# EAGLE schematic soundpuddle_standalone_mk1 (EAGLE 6.3)

## Sheet 1 of 2
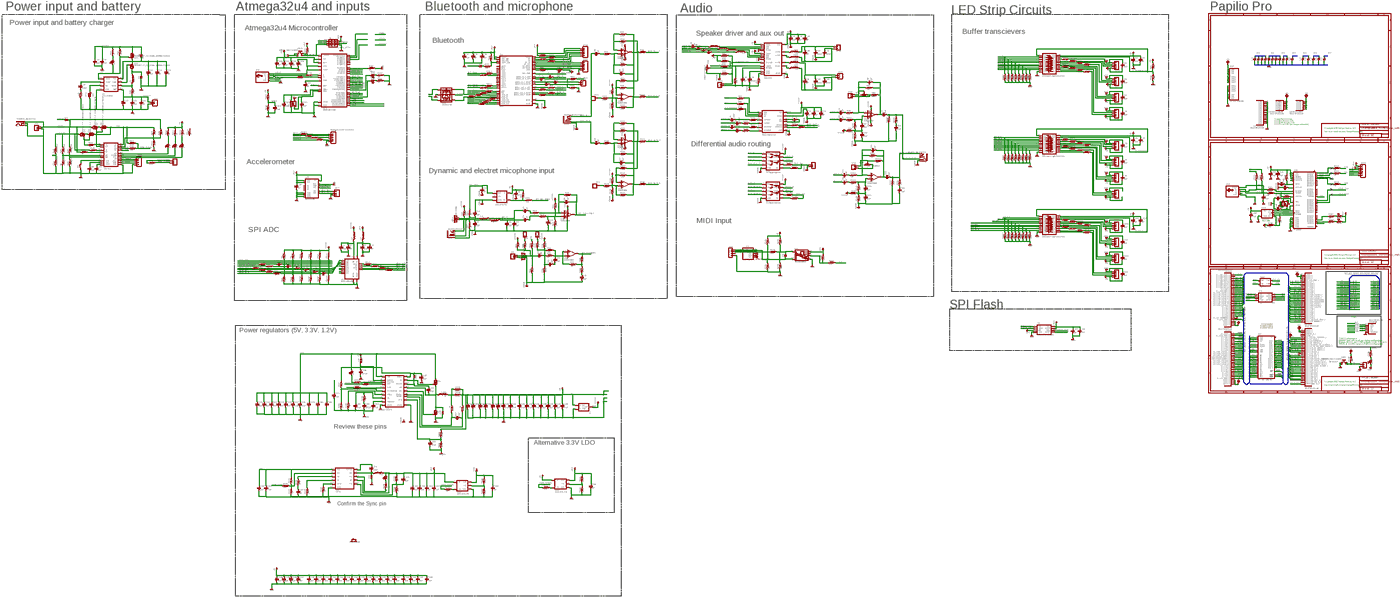
[diagram p0: schematic, sheet 1, overview]
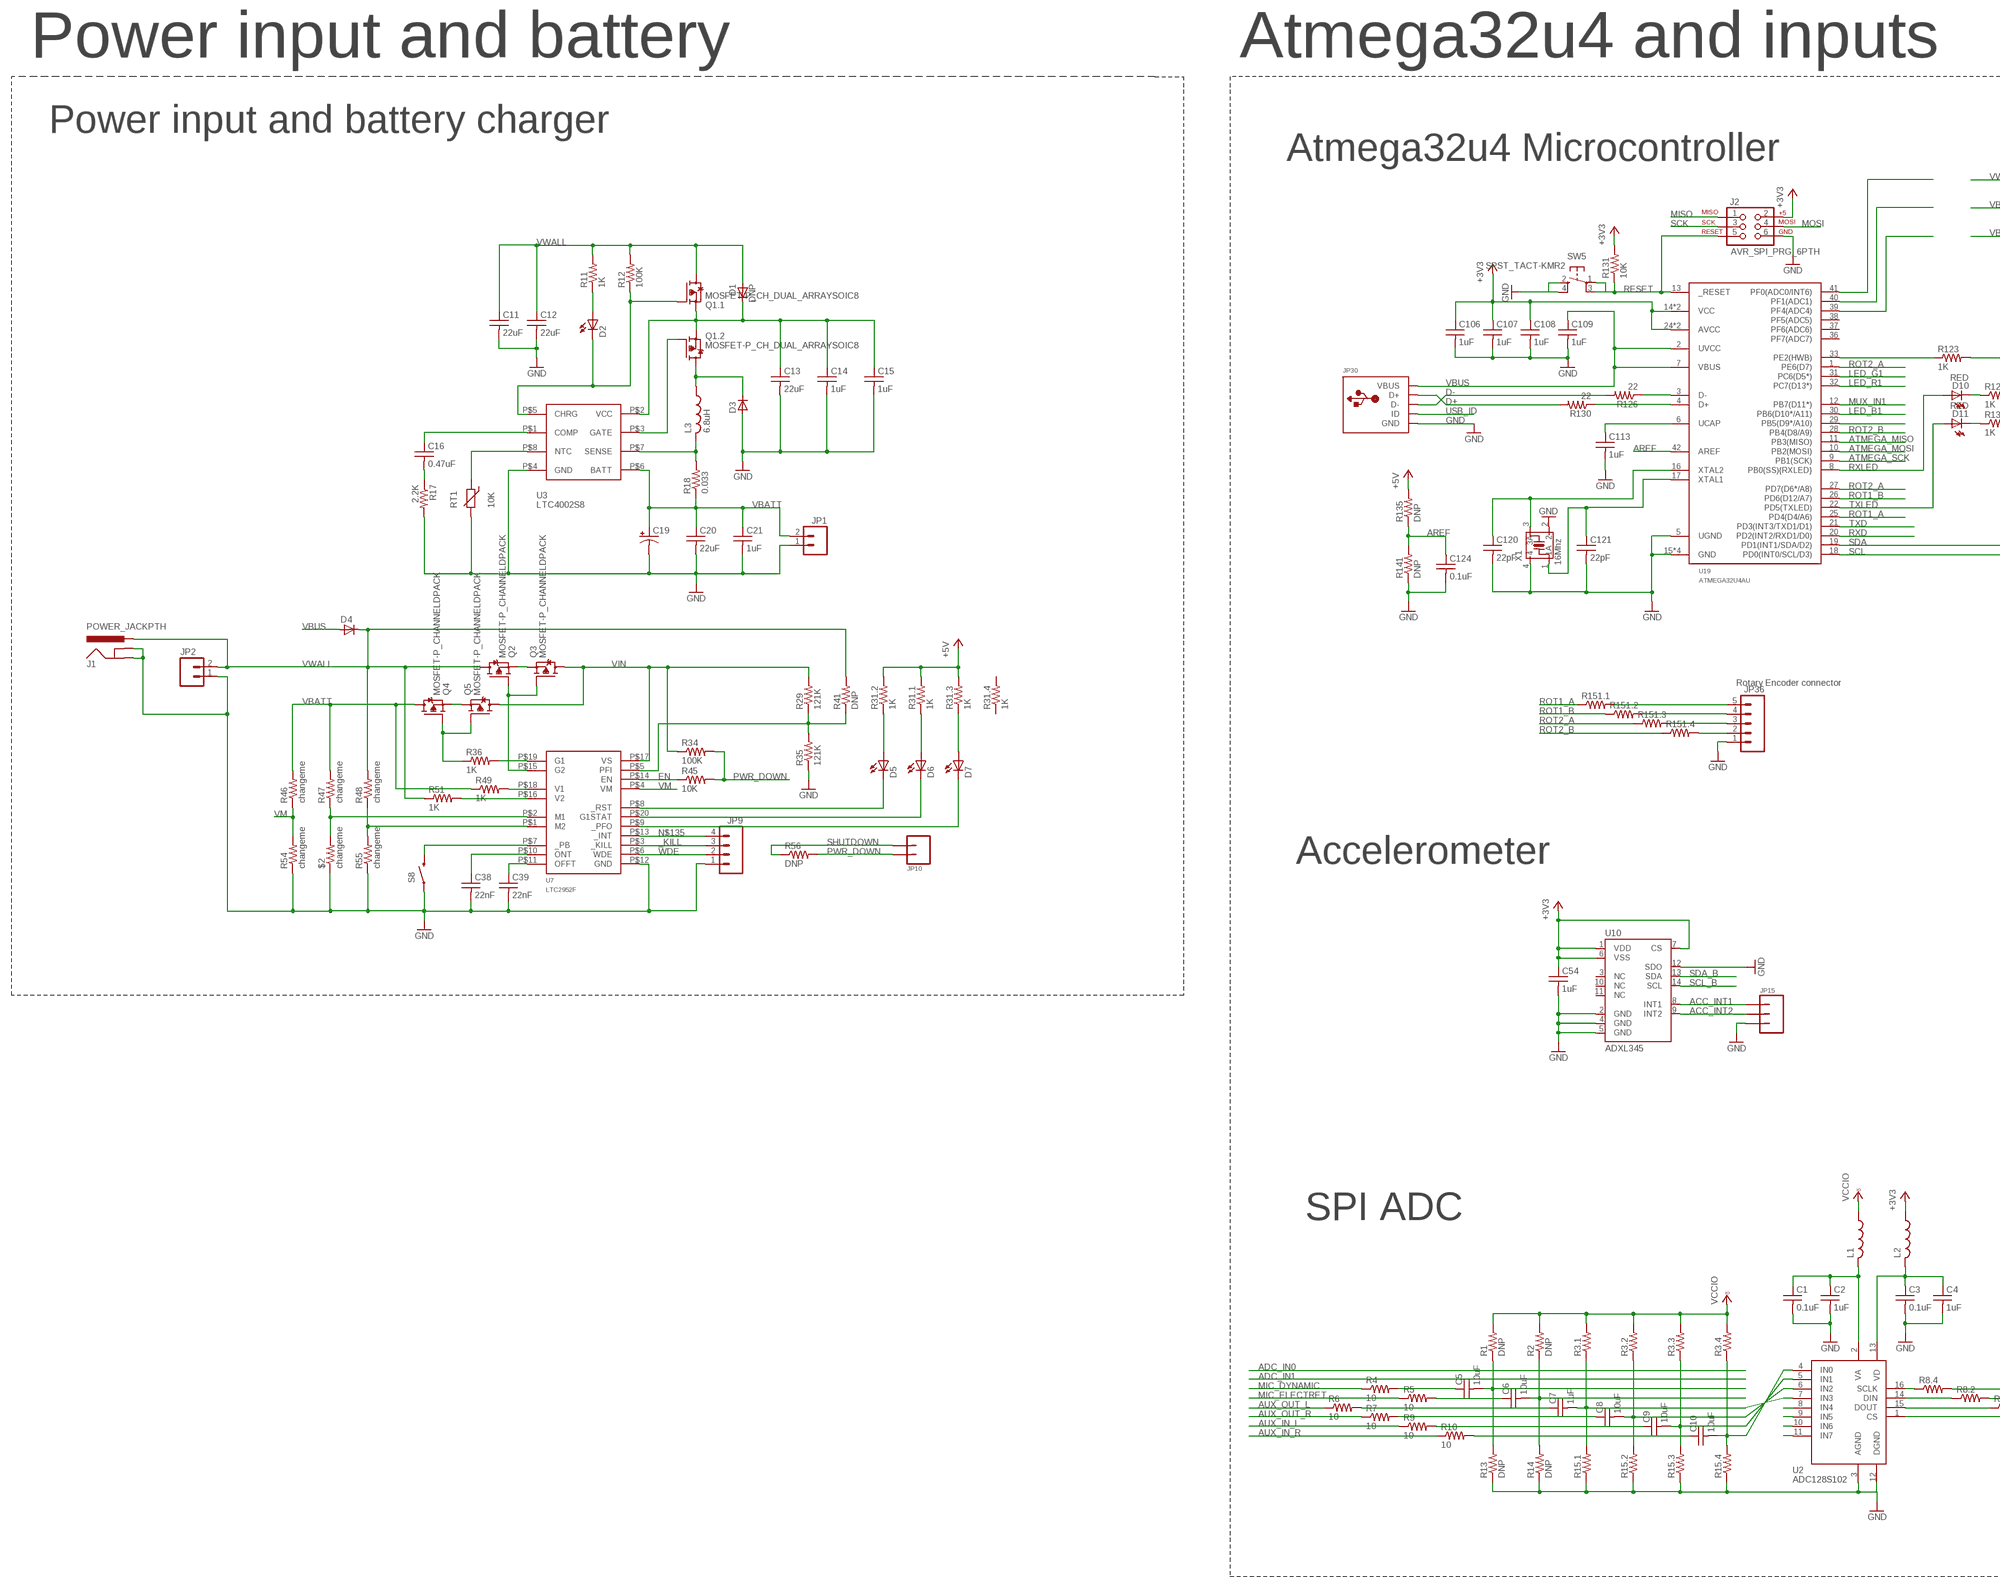
[diagram p1: schematic, sheet 1, part 1 of 7]
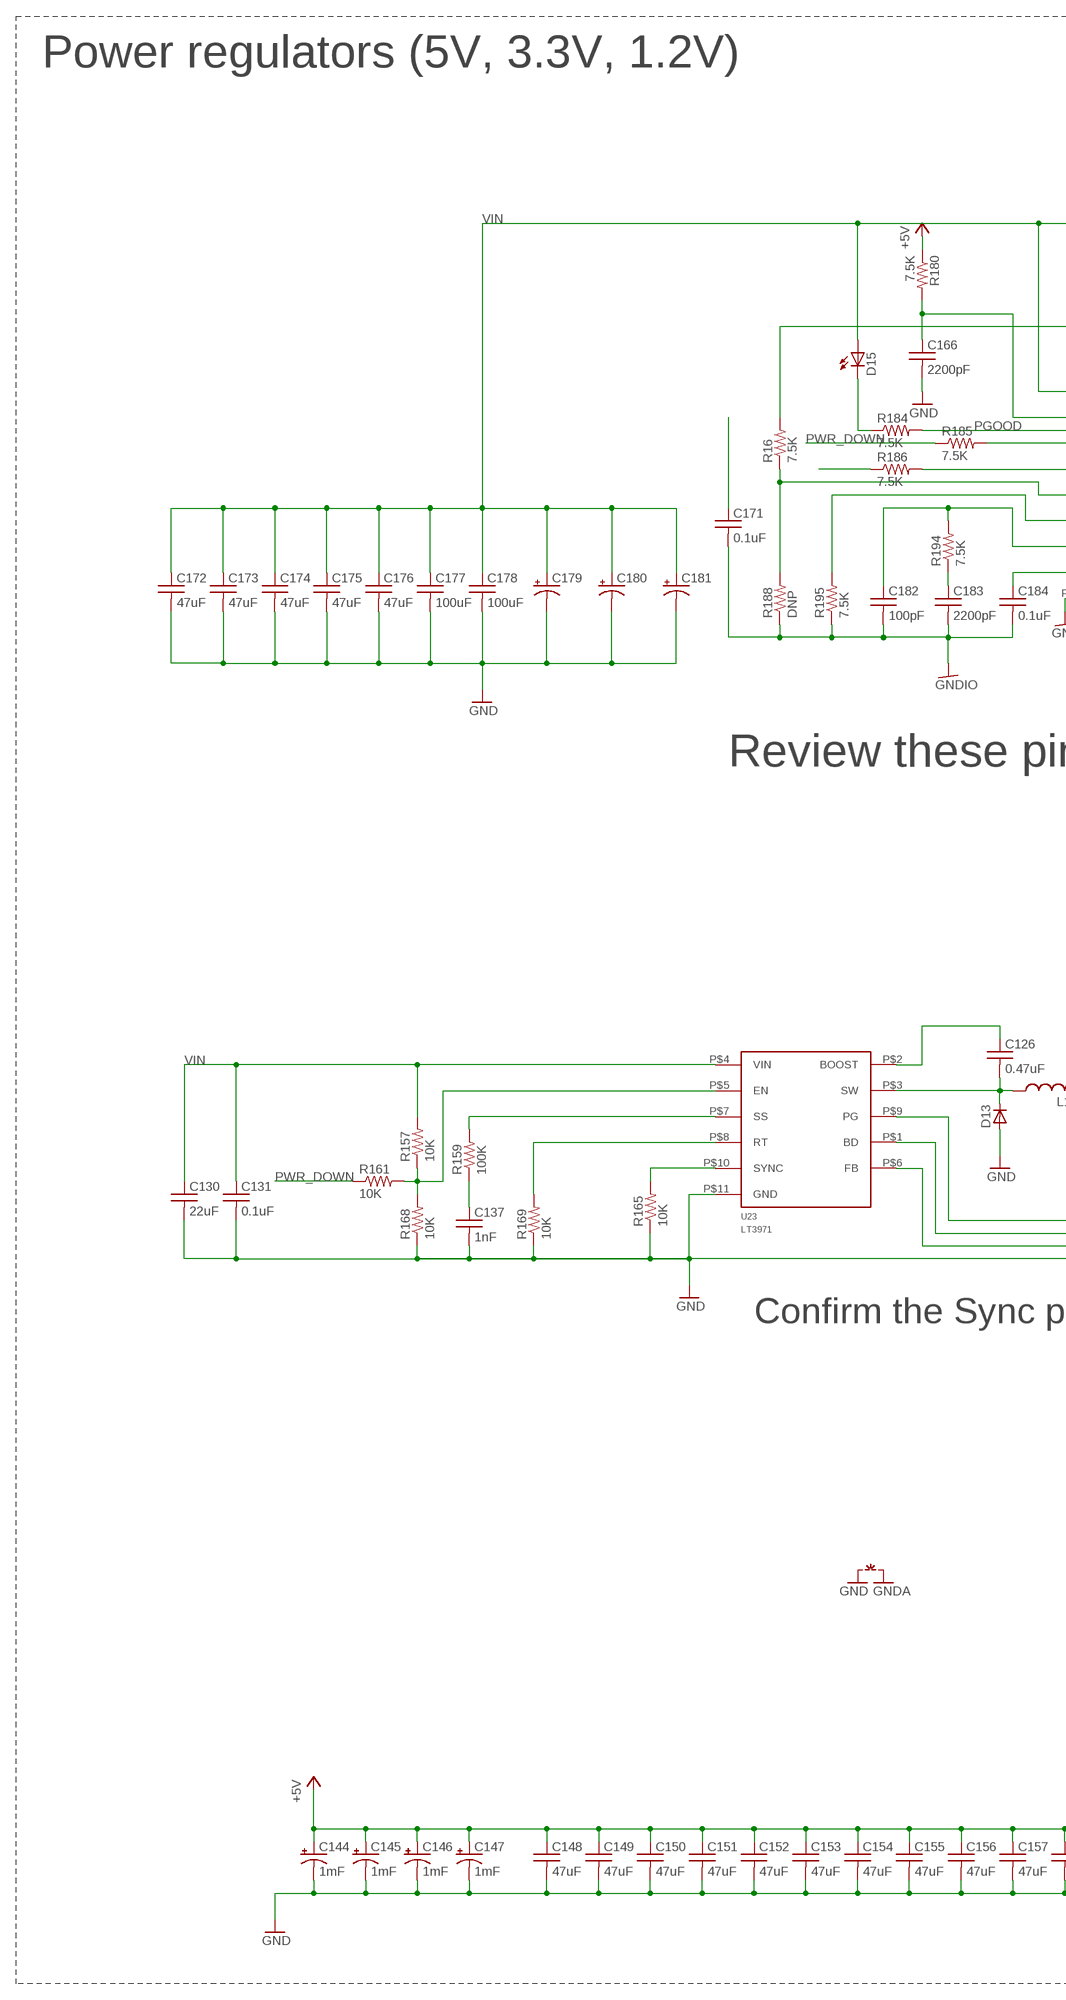
[diagram p2: schematic, sheet 1, part 2 of 7]
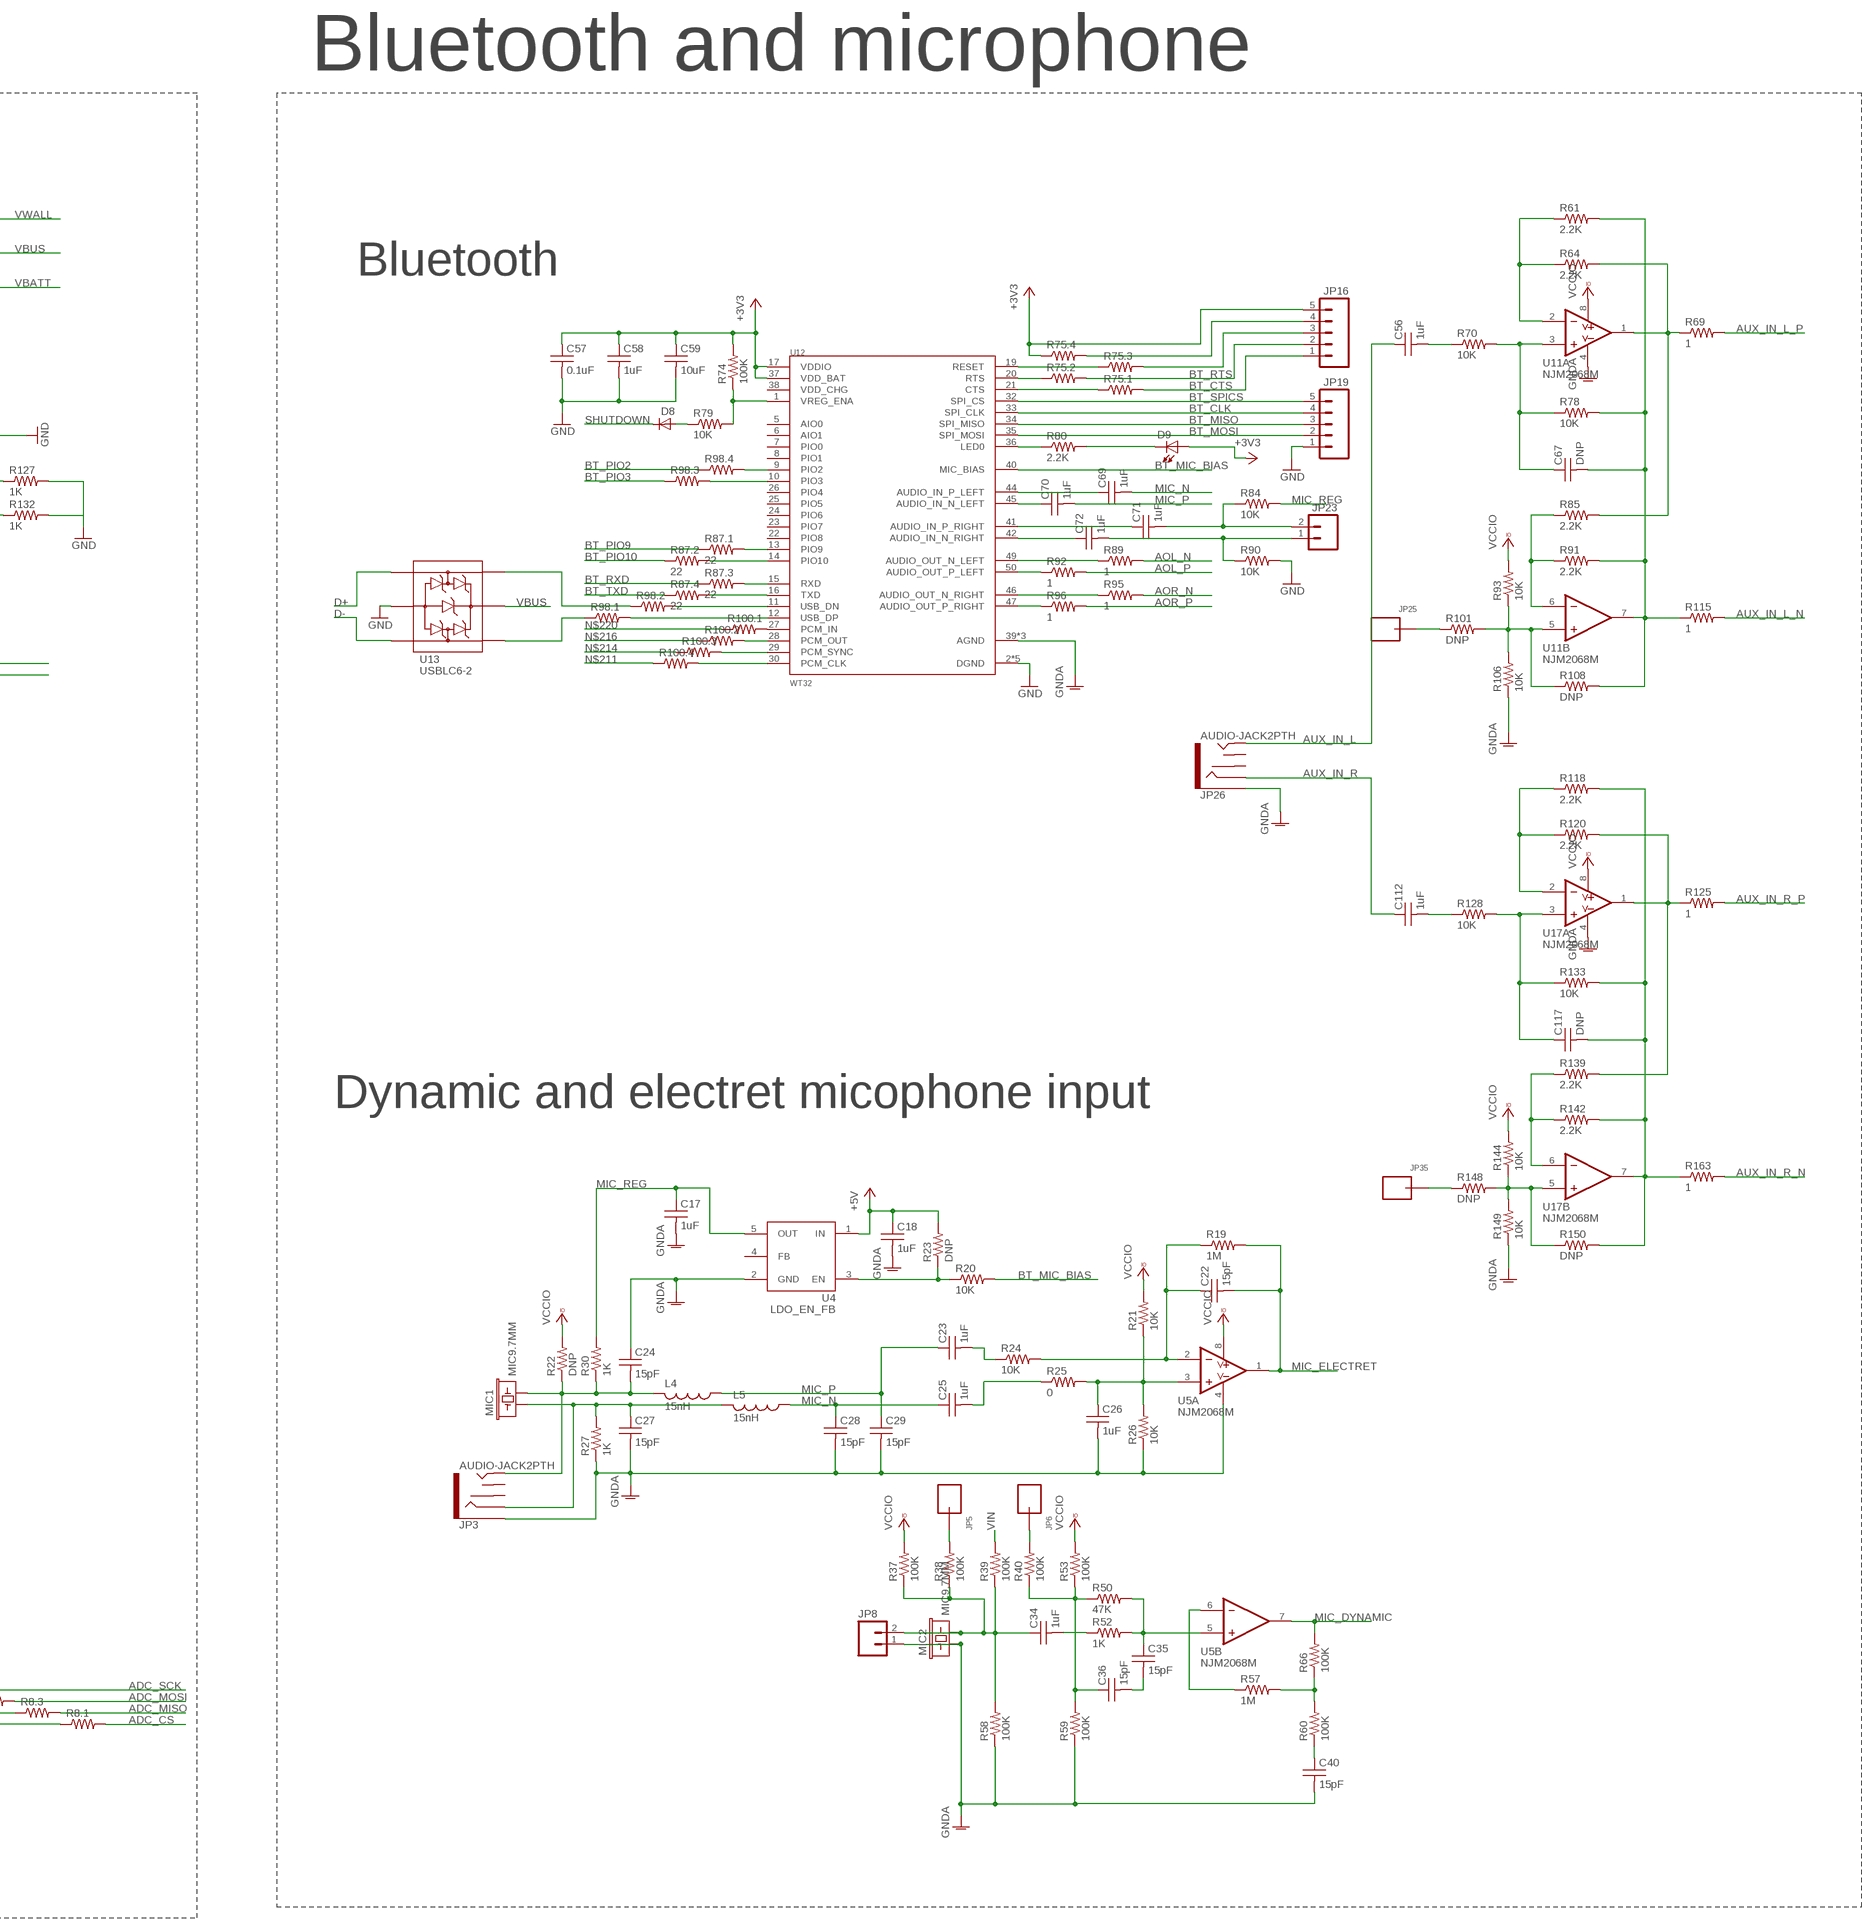
[diagram p3: schematic, sheet 1, part 3 of 7]
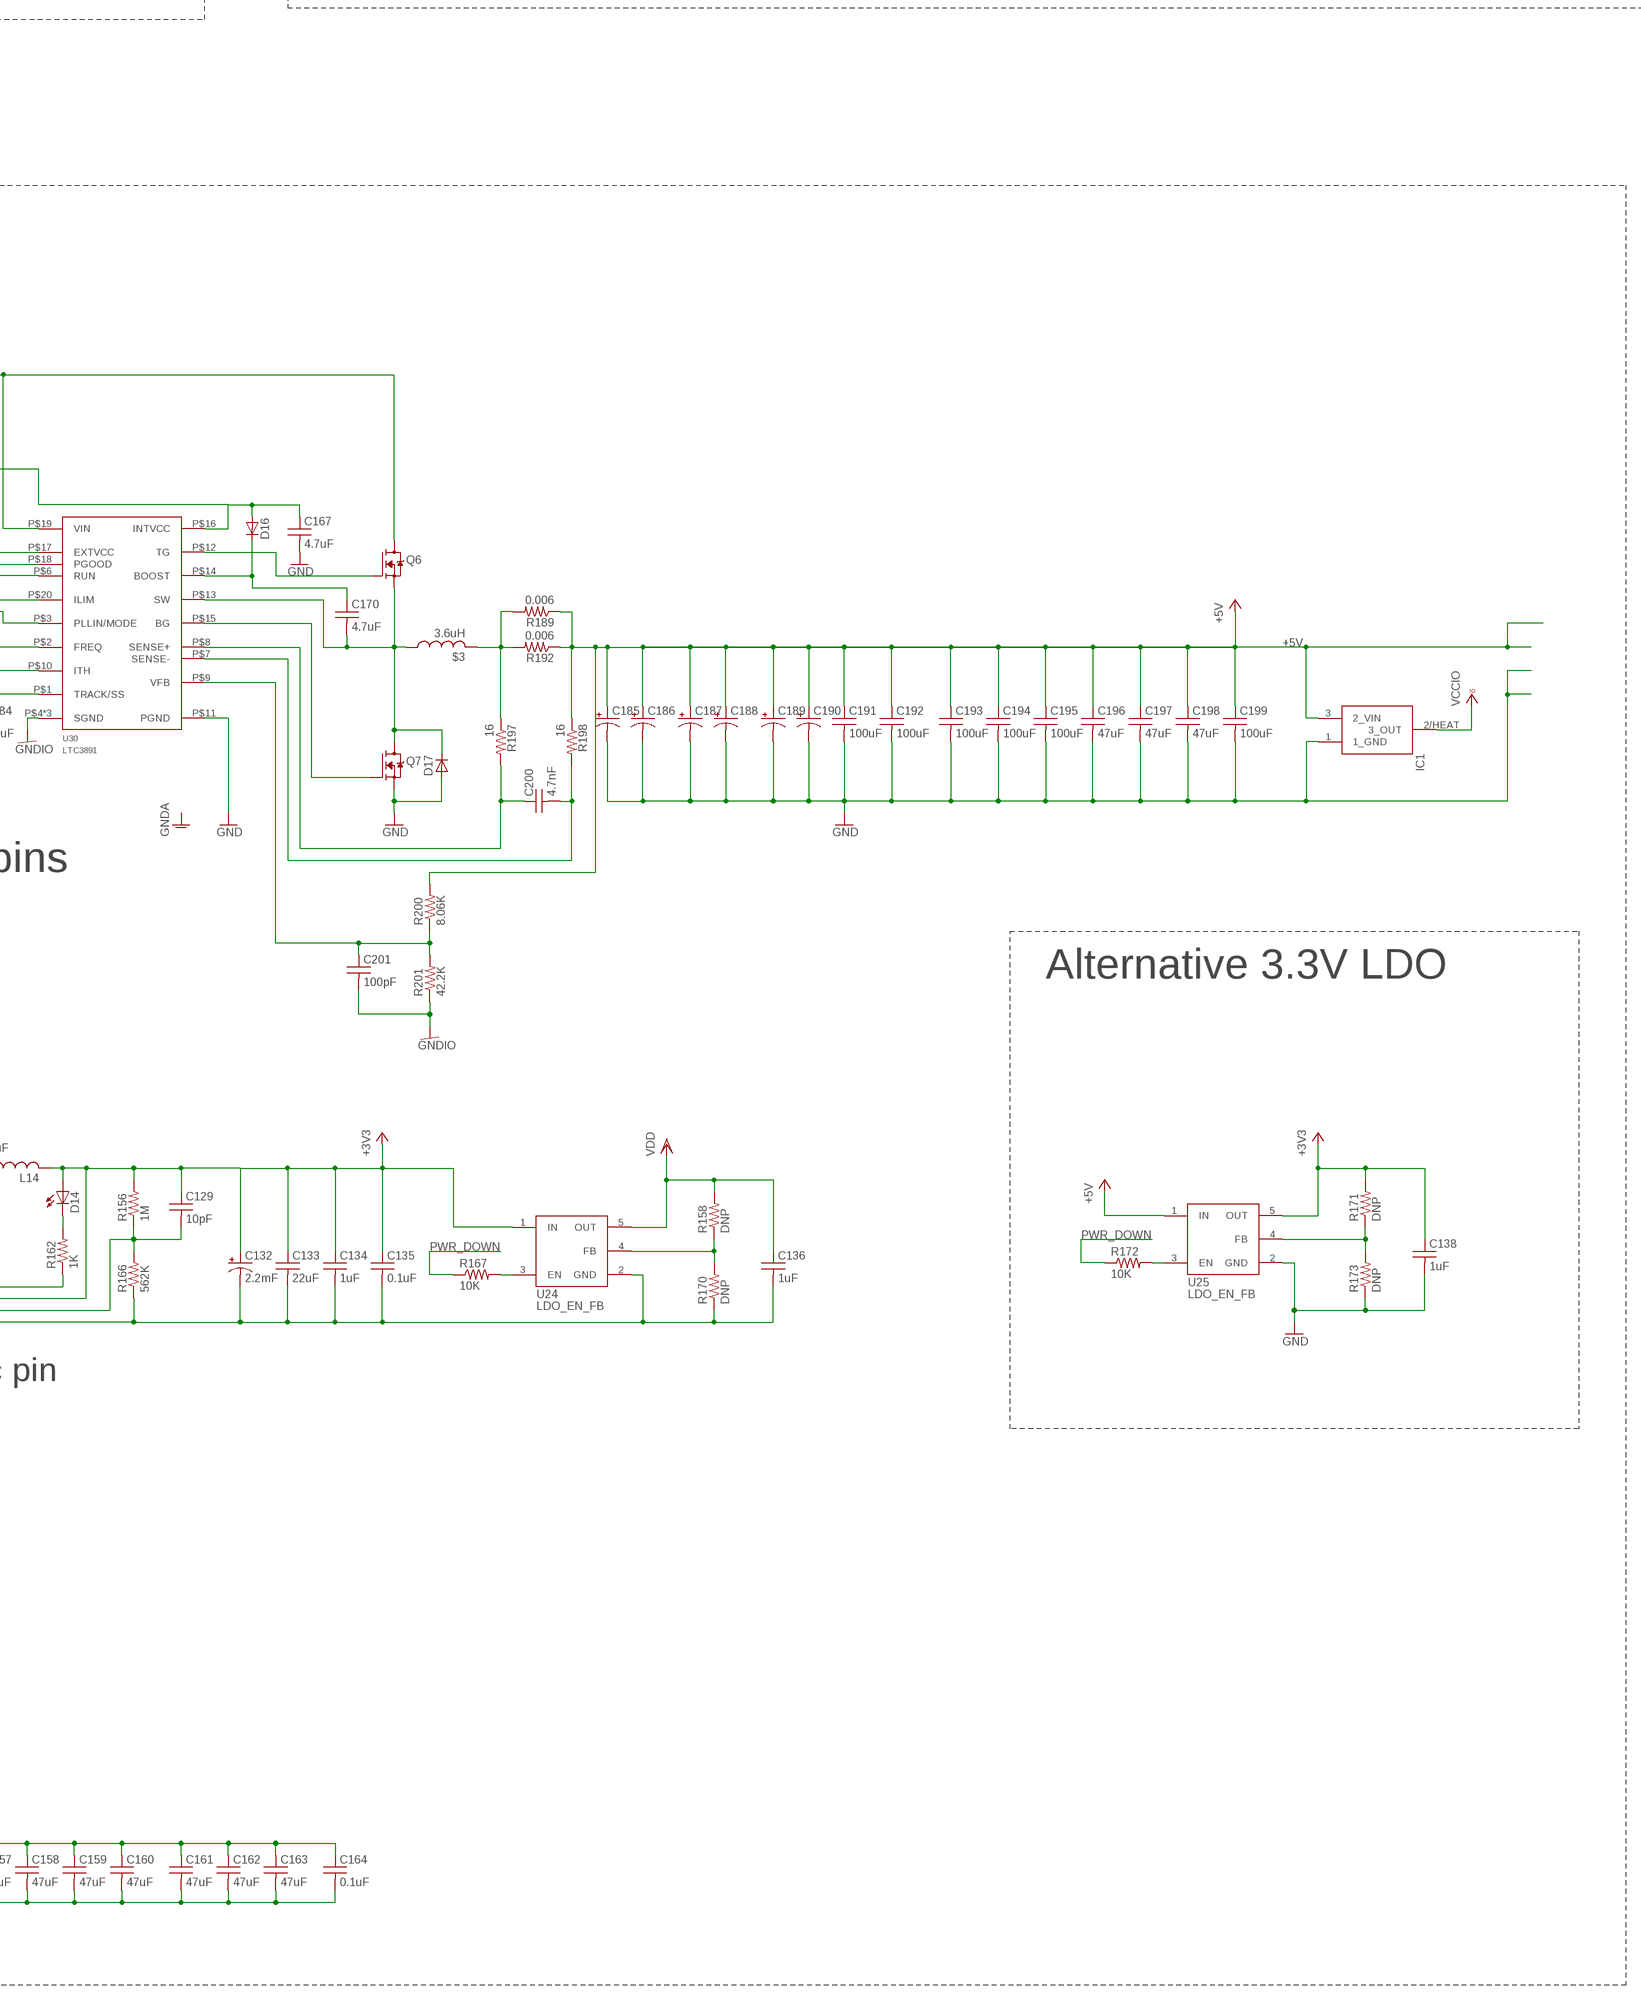
[diagram p4: schematic, sheet 1, part 4 of 7]
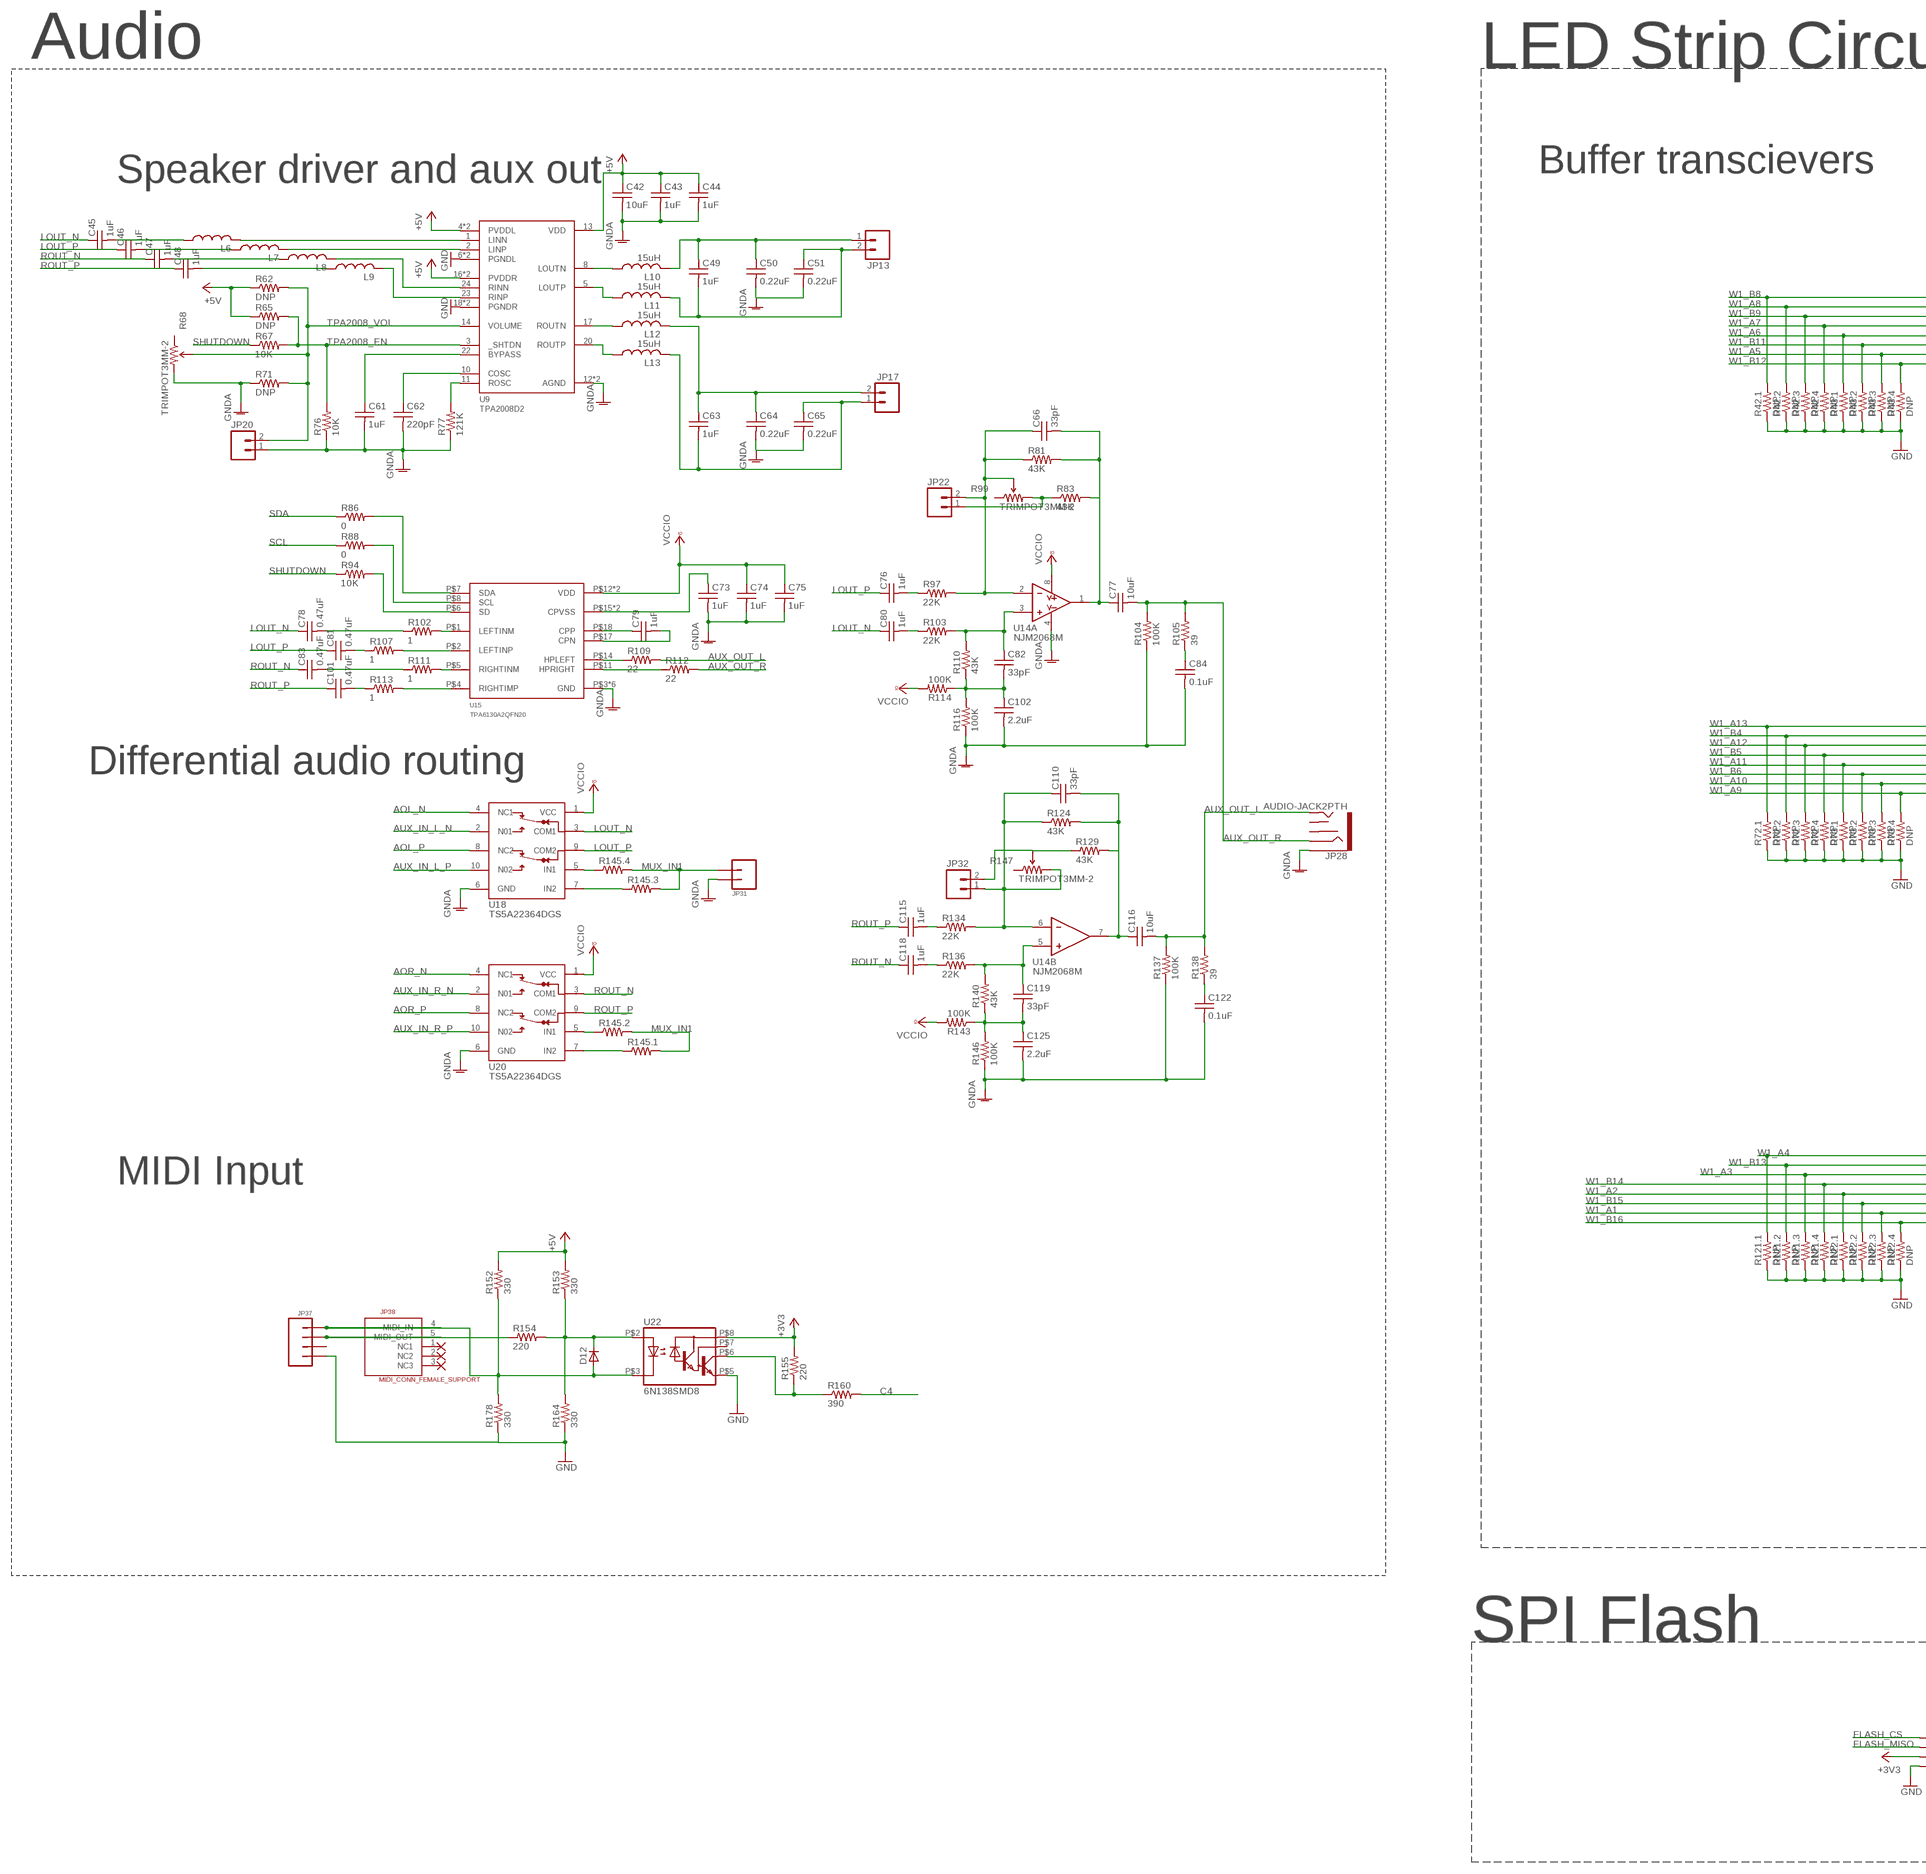
[diagram p5: schematic, sheet 1, part 5 of 7]
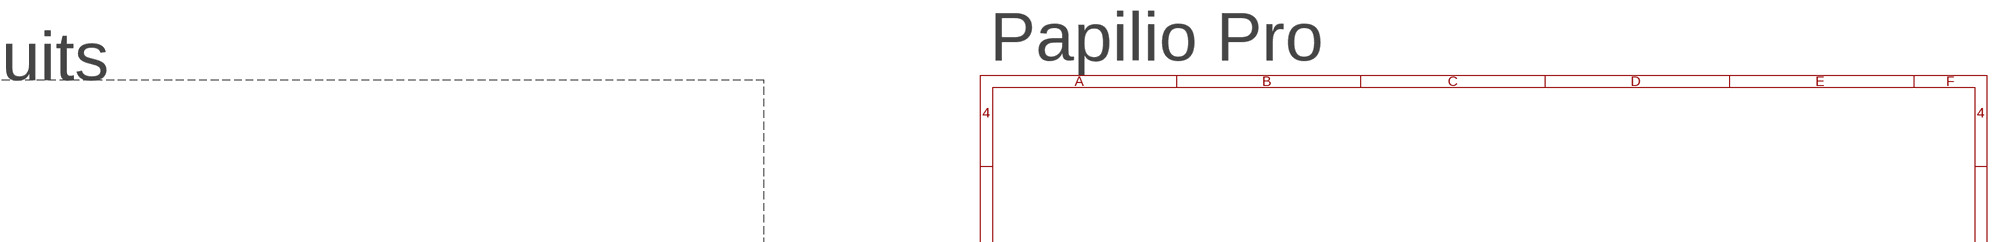
[diagram p6: schematic, sheet 1, part 6 of 7]
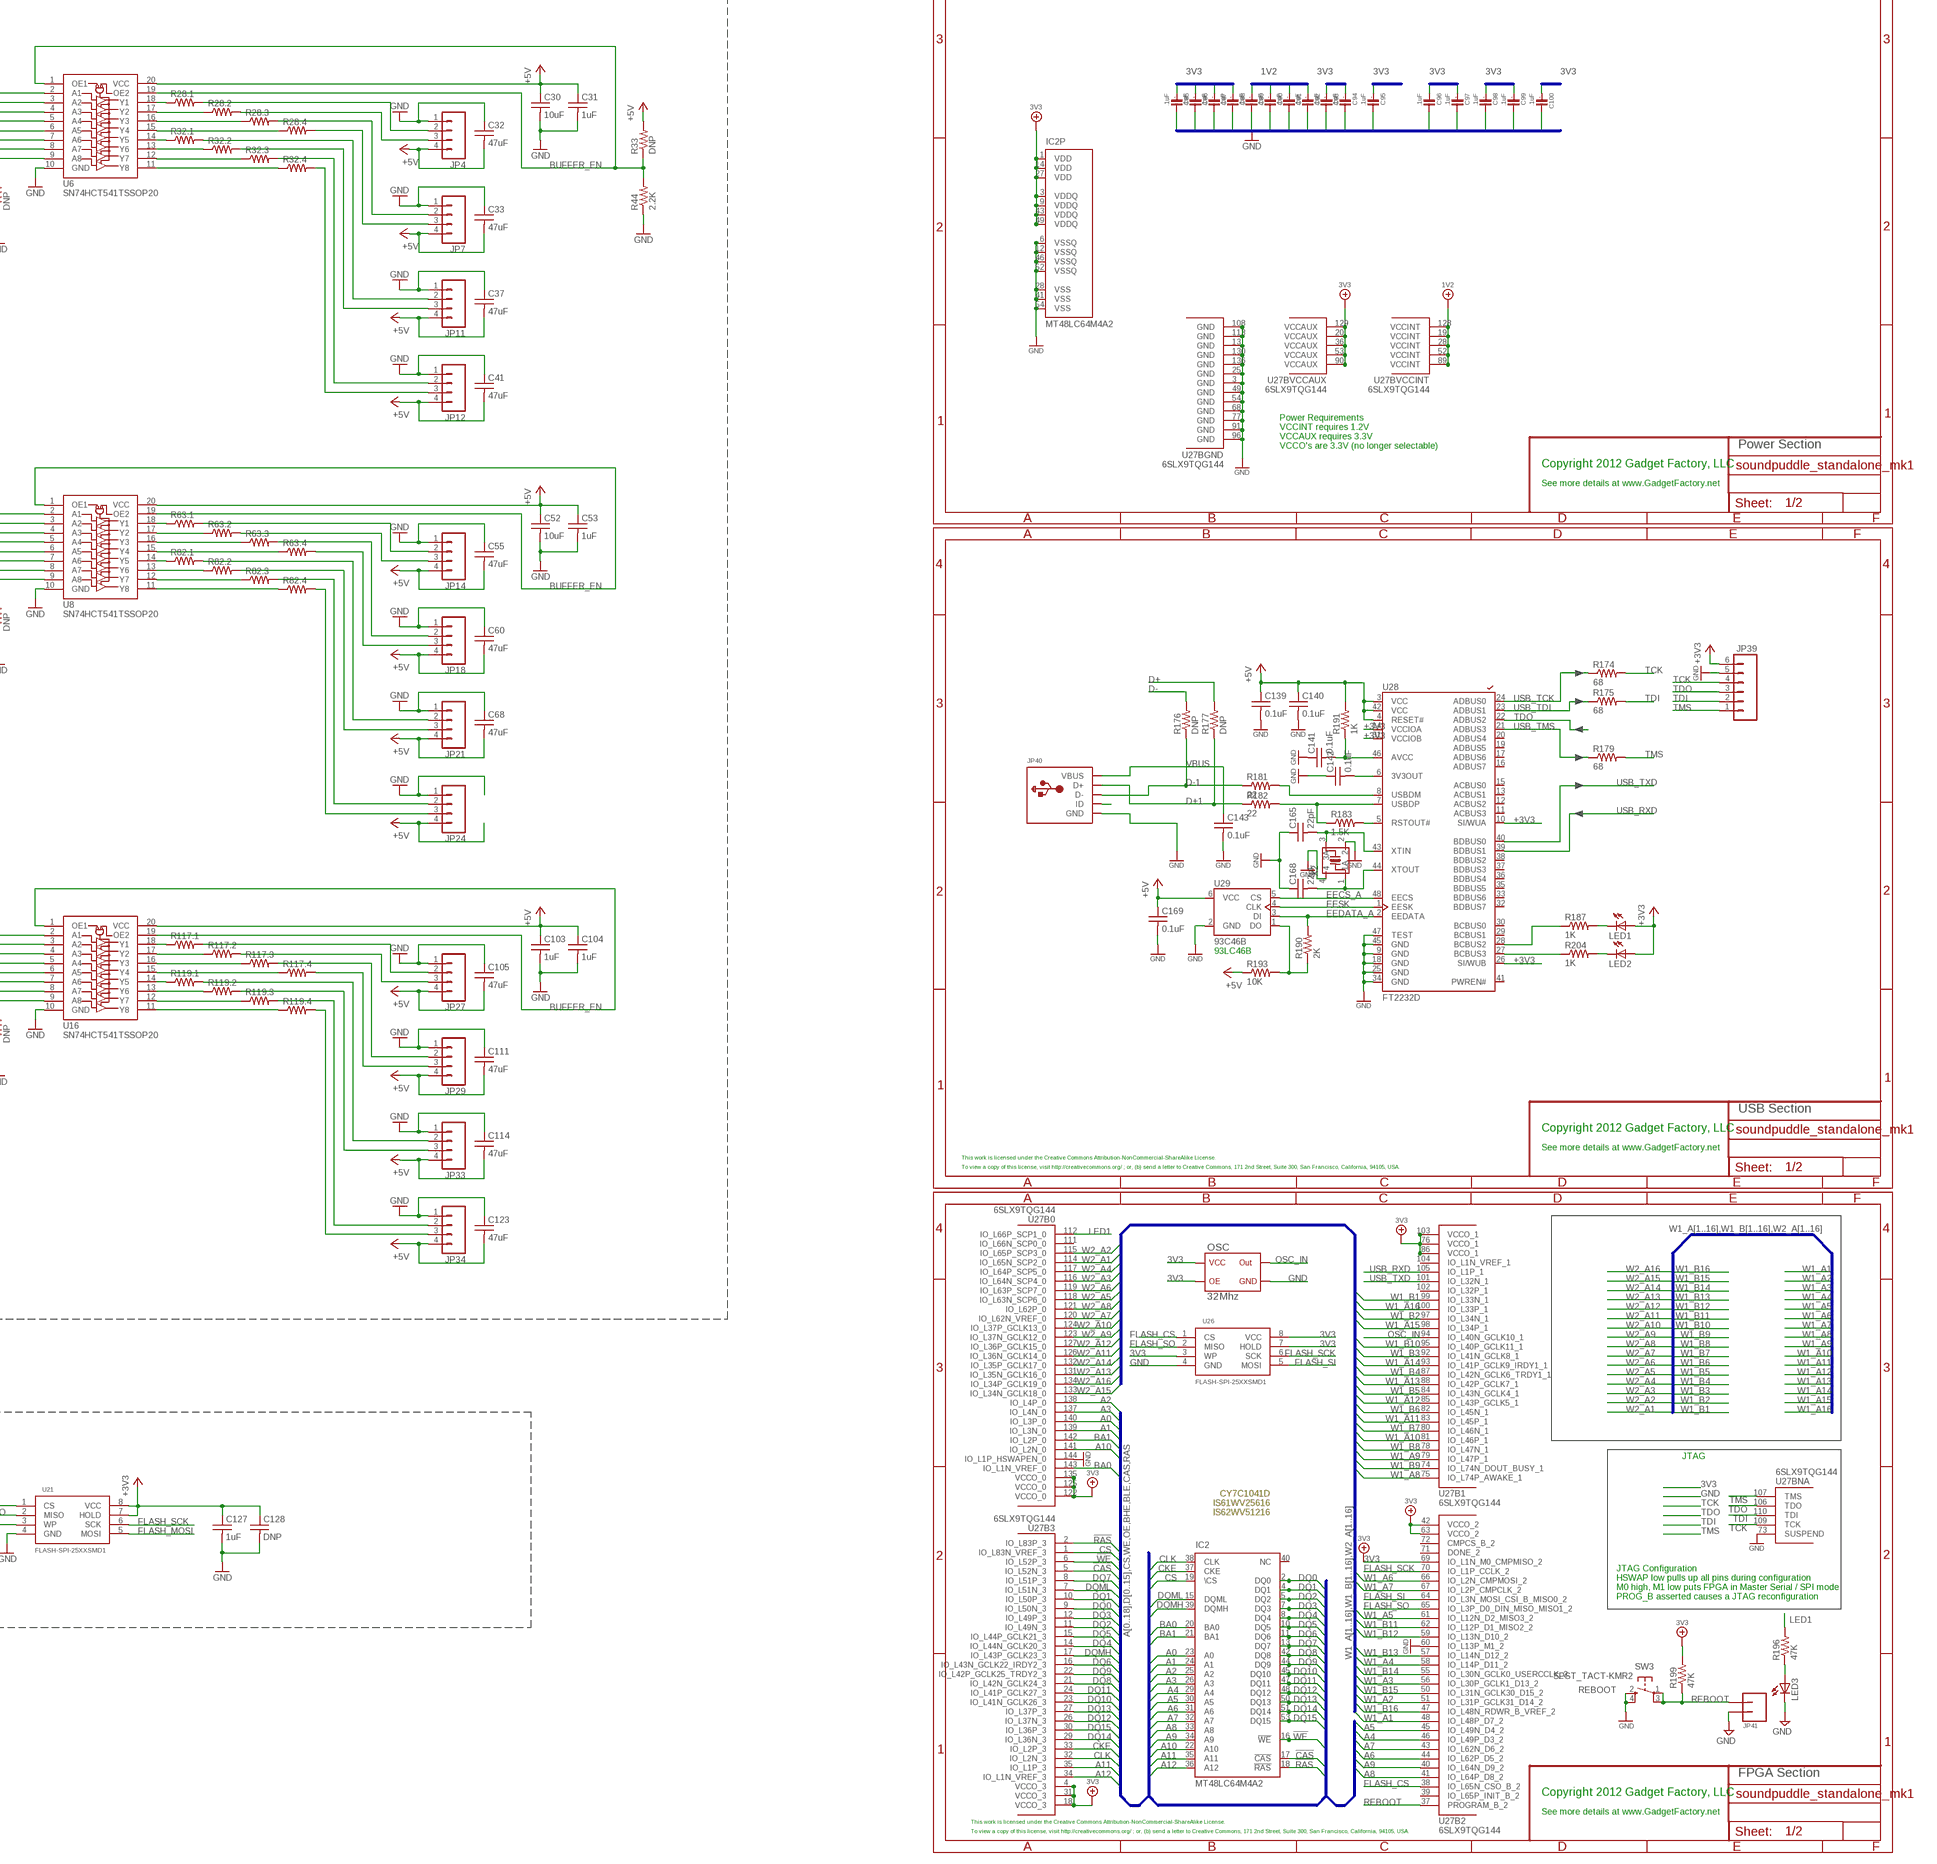
[diagram p7: schematic, sheet 1, part 7 of 7]

### Parts
$2  changeme  RESISTORR_0603  [0603]
$3  3.6uH  INDUCTORHC1  [INDUCTOR_HC1]
C1  0.1uF  CAPACITORC_0603  [0603]
C2  1uF  CAPACITORC_0603  [0603]
C3  0.1uF  CAPACITORC_0603  [0603]
C4  1uF  CAPACITORC_0603  [0603]
C5  10uF  CAPACITORC_0805  [0805]
C6  10uF  CAPACITORC_0805  [0805]
C7  1uF  CAPACITORC_0805  [0805]
C8  10uF  CAPACITORC_0805  [0805]
C9  10uF  CAPACITORC_0805  [0805]
C10  10uF  CAPACITORC_0805  [0805]
C11  22uF  CAPACITORC_0603  [0603]
C12  22uF  CAPACITORC_1206  [1206]
C13  22uF  CAPACITORC_1206  [1206]
C14  1uF  CAPACITORC_0603  [0603]
C15  1uF  CAPACITORC_0603  [0603]
C16  0.47uF  CAPACITORC_0603  [0603]
C17  1uF  CAPACITORC_0805  [0805]
C18  1uF  CAPACITORC_0603  [0603]
C19  CAPACITOR_ELEC6.3MM_DIA  [CAP_RADIAL_THRUHOLE_6.3MM_DIA]
C20  22uF  CAPACITORC_1206  [1206]
C21  1uF  CAPACITORC_0603  [0603]
C22  15pF  CAPACITORC_0603  [0603]
C23  1uF  CAPACITORC_0805  [0805]
C24  15pF  CAPACITORC_0603  [0603]
C25  1uF  CAPACITORC_0805  [0805]
C26  1uF  CAPACITORC_0603  [0603]
C27  15pF  CAPACITORC_0603  [0603]
C28  15pF  CAPACITORC_0603  [0603]
C29  15pF  CAPACITORC_0603  [0603]
C30  10uF  CAPACITORC_0603  [0603]
C31  1uF  CAPACITORC_0603  [0603]
C32  47uF  CAPACITORC_1206  [1206]
C33  47uF  CAPACITORC_1206  [1206]
C34  1uF  CAPACITORC_0805  [0805]
C35  15pF  CAPACITORC_0603  [0603]
C36  15pF  CAPACITORC_0603  [0603]
C37  47uF  CAPACITORC_1206  [1206]
C38  22nF  CAPACITORC_0603  [0603]
C39  22nF  CAPACITORC_0603  [0603]
C40  15pF  CAPACITORC_0603  [0603]
C41  47uF  CAPACITORC_1206  [1206]
C42  10uF  CAPACITORC_1206  [1206]
C43  1uF  CAPACITORC_0603  [0603]
C44  1uF  CAPACITORC_0603  [0603]
C45  1uF  CAPACITORC_0805  [0805]
C46  1uF  CAPACITORC_0805  [0805]
C47  1uF  CAPACITORC_0805  [0805]
C48  1uF  CAPACITORC_0805  [0805]
C49  1uF  CAPACITORC_1206  [1206]
C50  0.22uF  CAPACITORC_0603  [0603]
C51  0.22uF  CAPACITORC_0603  [0603]
C52  10uF  CAPACITORC_0603  [0603]
C53  1uF  CAPACITORC_0603  [0603]
C54  1uF  CAPACITORC_0603  [0603]
C55  47uF  CAPACITORC_1206  [1206]
C56  1uF  CAPACITORC_0805  [0805]
C57  0.1uF  CAPACITORC_0603  [0603]
C58  1uF  CAPACITORC_0603  [0603]
C59  10uF  CAPACITORC_1206  [1206]
C60  47uF  CAPACITORC_1206  [1206]
C61  1uF  CAPACITORC_0603  [0603]
C62  220pF  CAPACITORC_0603  [0603]
C63  1uF  CAPACITORC_1206  [1206]
C64  0.22uF  CAPACITORC_0603  [0603]
C65  0.22uF  CAPACITORC_0603  [0603]
C66  33pF  CAPACITORC_0603  [0603]
C67  DNP  CAPACITORC_0603  [0603]
C68  47uF  CAPACITORC_1206  [1206]
C69  1uF  CAPACITORC_0805  [0805]
C70  1uF  CAPACITORC_0805  [0805]
C71  1uF  CAPACITORC_0805  [0805]
C72  1uF  CAPACITORC_0805  [0805]
C73  1uF  CAPACITORC_0805  [0805]
C74  1uF  CAPACITORC_0805  [0805]
C75  1uF  CAPACITORC_0805  [0805]
C76  1uF  CAPACITORC_0805  [0805]
C77  10uF  CAPACITORC_1206  [1206]
C78  0.47uF  CAPACITORC_0805  [0805]
C79  1uF  CAPACITORC_0805  [0805]
C80  1uF  CAPACITORC_0805  [0805]
C81  0.47uF  CAPACITORC_0805  [0805]
C82  33pF  CAPACITORC_0603  [0603]
C83  0.47uF  CAPACITORC_0805  [0805]
C84  0.1uF  CAPACITORC_0603  [0603]
C85  .1uF  C0603  [0603]
C86  .1uF  C0603  [0603]
C87  .1uF  C0603  [0603]
C88  .1uF  C0603  [0603]
C89  .1uF  C0603  [0603]
C90  .1uF  C0603  [0603]
C91  .1uF  C0603  [0603]
C92  .1uF  C0603  [0603]
C93  .1uF  C0603  [0603]
C94  .1uF  C0603  [0603]
C95  .1uF  C0603  [0603]
C96  .1uF  C0603  [0603]
C97  .1uF  C0603  [0603]
C98  .1uF  C0603  [0603]
C99  .1uF  C0603  [0603]
C100  .1uF  C0603  [0603]
C101  0.47uF  CAPACITORC_0805  [0805]
C102  2.2uF  CAPACITORC_0603  [0603]
C103  1uF  CAPACITORC_1206  [1206]
C104  1uF  CAPACITORC_0603  [0603]
C105  47uF  CAPACITORC_1206  [1206]
C106  1uF  CAPACITORC_0603  [0603]
C107  1uF  CAPACITORC_0603  [0603]
C108  1uF  CAPACITORC_0603  [0603]
C109  1uF  CAPACITORC_0603  [0603]
C110  33pF  CAPACITORC_0603  [0603]
C111  47uF  CAPACITORC_1206  [1206]
C112  1uF  CAPACITORC_0805  [0805]
C113  1uF  CAPACITORC_0603  [0603]
C114  47uF  CAPACITORC_1206  [1206]
C115  1uF  CAPACITORC_0805  [0805]
C116  10uF  CAPACITORC_1206  [1206]
C117  DNP  CAPACITORC_0603  [0603]
C118  1uF  CAPACITORC_0805  [0805]
C119  33pF  CAPACITORC_0603  [0603]
C120  22pF  CAPACITORC_0603  [0603]
C121  22pF  CAPACITORC_0603  [0603]
C122  0.1uF  CAPACITORC_0603  [0603]
C123  47uF  CAPACITORC_1206  [1206]
C124  0.1uF  CAPACITORC_0603  [0603]
C125  2.2uF  CAPACITORC_0603  [0603]
C126  0.47uF  CAPACITORC_0603  [0603]
C127  1uF  CAPACITORC_0603  [0603]
C128  DNP  CAPACITORC_1206  [1206]
C129  10pF  CAPACITORC_0603  [0603]
C130  22uF  CAPACITORC_1206  [1206]
C131  0.1uF  CAPACITORC_0603  [0603]
C132  2.2mF  CAPACITOR_ELEC6.3MM_DIA  [CAP_RADIAL_THRUHOLE_6.3MM_DIA]
C133  22uF  CAPACITORC_1206  [1206]
C134  1uF  CAPACITORC_0603  [0603]
C135  0.1uF  CAPACITORC_1206  [1206]
C136  1uF  CAPACITORC_0603  [0603]
C137  1nF  CAPACITORC_0603  [0603]
C138  1uF  CAPACITORC_0603  [0603]
C139  0.1uF  CAPACITORC_0603  [0603]
C140  0.1uF  CAPACITORC_0603  [0603]
C141  0.1uF  CAPACITORC_0603  [0603]
C142  0.1uF  CAPACITORC_0603  [0603]
C143  0.1uF  CAPACITORC_0603  [0603]
C144  1mF  CPOL-USE5-8.5  [E5-8,5]
C145  1mF  CPOL-USE5-8.5  [E5-8,5]
C146  1mF  CPOL-USE5-8.5  [E5-8,5]
C147  1mF  CPOL-USE5-8.5  [E5-8,5]
C148  47uF  CAPACITORC_1206  [1206]
C149  47uF  CAPACITORC_1206  [1206]
C150  47uF  CAPACITOR2200  [2220]
C151  47uF  CAPACITORC_1206  [1206]
C152  47uF  CAPACITORC_1206  [1206]
C153  47uF  CAPACITORC_1206  [1206]
C154  47uF  CAPACITORC_1206  [1206]
C155  47uF  CAPACITORC_1206  [1206]
C156  47uF  CAPACITORC_1206  [1206]
C157  47uF  CAPACITORC_1206  [1206]
C158  47uF  CAPACITORC_1206  [1206]
C159  47uF  CAPACITORC_1206  [1206]
C160  47uF  CAPACITORC_1206  [1206]
C161  47uF  CAPACITORC_1206  [1206]
C162  47uF  CAPACITORC_1206  [1206]
C163  47uF  CAPACITORC_1206  [1206]
C164  0.1uF  CAPACITORC_0603  [0603]
C165  22pF  CAPACITORC_0603  [0603]
C166  2200pF  CAPACITORC_0603  [0603]
C167  4.7uF  CAPACITORC_0603  [0603]
C168  22pF  CAPACITORC_0603  [0603]
C169  0.1uF  CAPACITORC_0603  [0603]
C170  4.7uF  CAPACITORC_0603  [0603]
C171  0.1uF  CAPACITORC_0603  [0603]
C172  47uF  CAPACITOR2200  [2220]
C173  47uF  CAPACITOR2200  [2220]
C174  47uF  CAPACITORC_1206  [1206]
C175  47uF  CAPACITOR2200  [2220]
C176  47uF  CAPACITORC_1206  [1206]
C177  100uF  CAPACITOR2200  [2220]
C178  100uF  CAPACITOR2200  [2220]
C179  CAPACITOR_ELEC12.5MM  [CAP_RADIAL_THRUHOLE_12.5MM_DIA]
C180  CAPACITOR_ELEC12.5MM  [CAP_RADIAL_THRUHOLE_12.5MM_DIA]
C181  CAPACITOR_ELEC6.3MM_DIA  [CAP_RADIAL_THRUHOLE_6.3MM_DIA]
C182  100pF  CAPACITORC_0603  [0603]
C183  2200pF  CAPACITORC_0603  [0603]
C184  0.1uF  CAPACITORC_0603  [0603]
C185  CAPACITOR_ELEC6.3MM_DIA  [CAP_RADIAL_THRUHOLE_6.3MM_DIA]
C186  CAPACITOR_ELEC12.5MM  [CAP_RADIAL_THRUHOLE_12.5MM_DIA]
C187  CAPACITOR_ELEC12.5MM  [CAP_RADIAL_THRUHOLE_12.5MM_DIA]
C188  CAPACITOR_ELEC12.5MM  [CAP_RADIAL_THRUHOLE_12.5MM_DIA]
C189  CAPACITOR_ELEC6.3MM_DIA  [CAP_RADIAL_THRUHOLE_6.3MM_DIA]
C190  CAPACITOR_ELEC6.3MM_DIA  [CAP_RADIAL_THRUHOLE_6.3MM_DIA]
C191  100uF  CAPACITOR2200  [2220]
C192  100uF  CAPACITOR2200  [2220]
C193  100uF  CAPACITOR2200  [2220]
C194  100uF  CAPACITOR2200  [2220]
C195  100uF  CAPACITOR2200  [2220]
C196  47uF  CAPACITORC_1206  [1206]
C197  47uF  CAPACITORC_1206  [1206]
C198  47uF  CAPACITORC_1206  [1206]
C199  100uF  CAPACITOR2200  [2220]
C200  4.7nF  CAPACITORC_0603  [0603]
C201  100pF  CAPACITORC_0603  [0603]
D1  DNP  DIODE_SMDDO-214AC  [DIODE_DO-214AC]
D2  LED0603  [LED_0603]
D3  DIODE_SMDDO-214AC  [DIODE_DO-214AC]
D4  DIODE_SMDSOD-123F  [SOD-123F]
D5  LED0603  [LED_0603]
D6  LED0603  [LED_0603]
D7  LED0603  [LED_0603]
D8  DIODE_SMD603  [0603_D]
D9  LED0805  [LED_0805]
D10  RED  LED0603  [LED_0603]
D11  RED  LED0603  [LED_0603]
D12  DIODE_SMDSOD-323  [SOD-323]
D13  DIODE_SMDDO-214AC  [DIODE_DO-214AC]
D14  LED0603  [LED_0603]
D15  LED0603  [LED_0603]
D16  DIODE_SMDSOD-123F  [SOD-123F]
D17  DIODE_SMDDO-214AB  [DIODE_DO-214AB]
IC1  LDODPAK  [DPACK_1]
IC2  MT48LC64M4A2  [TSOP54-400]
J1  POWER_JACKPTH  [POWER_JACK_PTH]
J2  AVR_SPI_PRG_6PTH  [2X3]
JP1  M02JST-PTH-2  [JST-2-PTH]
JP2  M02JST-PTH-2  [JST-2-PTH]
JP3  AUDIO-JACK2PTH  [AUDIO-JACK]
JP4  M04POLAR  [MOLEX-1X4]
JP5  HEADER-SMALL-1PIN  [HEADER-SMALL-1PIN-0.036IN]
JP6  HEADER-SMALL-1PIN  [HEADER-SMALL-1PIN-0.036IN]
JP7  M04POLAR  [MOLEX-1X4]
JP8  M02PTH  [1X02]
JP9  M04PTH  [1X04]
JP10  HEADER-SMALL-2PIN  [HEADER-SMALL-2PIN-0.036IN]
JP11  M04POLAR  [MOLEX-1X4]
JP12  M04POLAR  [MOLEX-1X4]
JP13  M02POLAR  [MOLEX-1X2]
JP14  M04POLAR  [MOLEX-1X4]
JP15  HEADER-SMALL-3PIN  [HEADER-SMALL-3PIN-0.036IN]
JP16  M05PTH  [1X05]
JP17  M02POLAR  [MOLEX-1X2]
JP18  M04POLAR  [MOLEX-1X4]
JP19  M05PTH  [1X05]
JP20  M02PTH  [1X02]
JP21  M04POLAR  [MOLEX-1X4]
JP22  M02PTH  [1X02]
JP23  M02PTH  [1X02]
JP24  M04POLAR  [MOLEX-1X4]
JP25  HEADER-SMALL-1PIN  [HEADER-SMALL-1PIN-0.036IN]
JP26  AUDIO-JACK2PTH  [AUDIO-JACK]
JP27  M04POLAR  [MOLEX-1X4]
JP28  AUDIO-JACK2PTH  [AUDIO-JACK]
JP29  M04POLAR  [MOLEX-1X4]
JP30  USBTHM  [USB-MINIB-THM]
JP31  HEADER-SMALL-2PIN  [HEADER-SMALL-2PIN-0.036IN]
JP32  M02PTH  [1X02]
JP33  M04POLAR  [MOLEX-1X4]
JP34  M04POLAR  [MOLEX-1X4]
JP35  HEADER-SMALL-1PIN  [HEADER-SMALL-1PIN-0.036IN]
JP36  M05PTH  [1X05]
JP37  HEADER-SMALL-4PIN  [HEADER-SMALL-4PIN-0.036IN]
JP38  MIDI_CONN_FEMALE_SUPPORT  [DIN_5_FEMALE_SUPPORT]
JP39  M06SIP  [1X06]
JP40  USBTHM  [USB-MINIB-THM]
JP41  HEADER-SMALL-2PIN  [HEADER-SMALL-2PIN-0.036IN]
L1  INDUCTOR0603  [0603]
L2  INDUCTOR0603  [0603]
L3  6.8uH  INDUCTOR10X10MM  [INDUCTOR_10X10MM]
L4  15nH  INDUCTOR0805  [0805]
L5  15nH  INDUCTOR0805  [0805]
L6  INDUCTOR0805  [0805]
L7  INDUCTOR0805  [0805]
L8  INDUCTOR0805  [0805]
L9  INDUCTOR0805  [0805]
L10  15uH  INDUCTOR1206  [1206]
L11  15uH  INDUCTOR1206  [1206]
L12  15uH  INDUCTOR1206  [1206]
L13  15uH  INDUCTOR1206  [1206]
L14  INDUCTOR10X10MM  [INDUCTOR_10X10MM]
LED1  LED0603  [LED_0603]
LED2  LED0603  [LED_0603]
LED3  LED0603  [LED_0603]
MIC1  MIC9.7MM  [MIC-9.7MM]
MIC2  MIC9.7MM  [MIC-9.7MM]
OSC  32Mhz  OSC1  [OSC1]
Q1  MOSFET-P_CH_DUAL_ARRAYSOIC8  [SOIC8]
Q2  MOSFET-P_CHANNELDPACK  [DPACK_1]
Q3  MOSFET-P_CHANNELDPACK  [DPACK_1]
Q4  MOSFET-P_CHANNELDPACK  [DPACK_1]
Q5  MOSFET-P_CHANNELDPACK  [DPACK_1]
Q6  MOSFET_N_CHANNELLFPAK  [POWERPAK_SO-8_LFPAK]
Q7  MOSFET_N_CHANNELLFPAK  [POWERPAK_SO-8_LFPAK]
R1  DNP  RESISTORR_0603  [0603]
R2  DNP  RESISTORR_0603  [0603]
R3  RESISTOR_ARRAY_4CHCRA06S  [RESISTOR_ARRAY_1206_4CH_CRA06S]
R4  10  RESISTORR_0805  [0805]
R5  10  RESISTORR_0805  [0805]
R6  10  RESISTORR_0805  [0805]
R7  10  RESISTORR_0805  [0805]
R8  RESISTOR_ARRAY_4CHCRA06S  [RESISTOR_ARRAY_1206_4CH_CRA06S]
R9  10  RESISTORR_0805  [0805]
R10  10  RESISTORR_0805  [0805]
R11  1K  RESISTORR_0603  [0603]
R12  100K  RESISTORR_0603  [0603]
R13  DNP  RESISTORR_0603  [0603]
R14  DNP  RESISTORR_0603  [0603]
R15  RESISTOR_ARRAY_4CHCRA06S  [RESISTOR_ARRAY_1206_4CH_CRA06S]
R16  7.5K  RESISTORR_0603  [0603]
R17  2.2K  RESISTORR_0603  [0603]
R18  0.033  RESISTORR_1206  [1206]
R19  1M  RESISTORR_0603  [0603]
R20  10K  RESISTORR_0603  [0603]
R21  10K  RESISTORR_0603  [0603]
R22  DNP  RESISTORR_0603  [0603]
R23  DNP  RESISTORR_0603  [0603]
R24  10K  RESISTORR_0603  [0603]
R25  0  RESISTORR_0603  [0603]
R26  10K  RESISTORR_0603  [0603]
R27  1K  RESISTORR_0603  [0603]
R28  RESISTOR_ARRAY_4CHCRA06S  [RESISTOR_ARRAY_1206_4CH_CRA06S]
R29  121K  RESISTORR_0603  [0603]
R30  1K  RESISTORR_0603  [0603]
R31  1K  RESISTOR_ARRAY_4CHCRA06S  [RESISTOR_ARRAY_1206_4CH_CRA06S]
R32  RESISTOR_ARRAY_4CHCRA06S  [RESISTOR_ARRAY_1206_4CH_CRA06S]
R33  DNP  RESISTORR_0603  [0603]
R34  100K  RESISTORR_0603  [0603]
R35  121K  RESISTORR_0603  [0603]
R36  1K  RESISTORR_0603  [0603]
R37  100K  RESISTORR_0603  [0603]
R38  100K  RESISTORR_0603  [0603]
R39  100K  RESISTORR_0603  [0603]
R40  100K  RESISTORR_0603  [0603]
R41  DNP  RESISTORR_0603  [0603]
R42  DNP  RESISTOR_ARRAY_4CHCRA06S  [RESISTOR_ARRAY_1206_4CH_CRA06S]
R43  DNP  RESISTOR_ARRAY_4CHCRA06S  [RESISTOR_ARRAY_1206_4CH_CRA06S]
R44  2.2K  RESISTORR_0603  [0603]
R45  10K  RESISTORR_0603  [0603]
R46  changeme  RESISTORR_0603  [0603]
R47  changeme  RESISTORR_0603  [0603]
R48  changeme  RESISTORR_0603  [0603]
R49  1K  RESISTORR_0603  [0603]
R50  47K  RESISTORR_0603  [0603]
R51  1K  RESISTORR_0603  [0603]
R52  1K  RESISTORR_0603  [0603]
R53  100K  RESISTORR_0603  [0603]
R54  changeme  RESISTORR_0603  [0603]
R55  changeme  RESISTORR_0603  [0603]
R56  DNP  RESISTORR_0603  [0603]
R57  1M  RESISTORR_0603  [0603]
R58  100K  RESISTORR_0603  [0603]
R59  100K  RESISTORR_0603  [0603]
R60  100K  RESISTORR_0603  [0603]
R61  2.2K  RESISTORR_0603  [0603]
R62  DNP  RESISTORR_0603  [0603]
R63  RESISTOR_ARRAY_4CHCRA06S  [RESISTOR_ARRAY_1206_4CH_CRA06S]
R64  2.2K  RESISTORR_0603  [0603]
R65  DNP  RESISTORR_0603  [0603]
R66  100K  RESISTORR_0603  [0603]
R67  10K  RESISTORR_0603  [0603]
R68  TRIMPOT3MM-2  [TRIMPOT-3MM-2]
R69  1  RESISTORR_0805  [0805]
R70  10K  RESISTORR_0805  [0805]
R71  DNP  RESISTORR_0603  [0603]
R72  DNP  RESISTOR_ARRAY_4CHCRA06S  [RESISTOR_ARRAY_1206_4CH_CRA06S]
R73  DNP  RESISTOR_ARRAY_4CHCRA06S  [RESISTOR_ARRAY_1206_4CH_CRA06S]
R74  100K  RESISTORR_0603  [0603]
R75  RESISTOR_ARRAY_4CHCRA06S  [RESISTOR_ARRAY_1206_4CH_CRA06S]
R76  10K  RESISTORR_0603  [0603]
R77  121K  RESISTORR_0603  [0603]
R78  10K  RESISTORR_0603  [0603]
R79  10K  RESISTORR_0603  [0603]
R80  2.2K  RESISTORR_0603  [0603]
R81  43K  RESISTORR_0603  [0603]
R82  RESISTOR_ARRAY_4CHCRA06S  [RESISTOR_ARRAY_1206_4CH_CRA06S]
R83  43K  RESISTORR_0603  [0603]
R84  10K  RESISTORR_0805  [0805]
R85  2.2K  RESISTORR_0603  [0603]
R86  0  RESISTORR_0603  [0603]
R87  22  RESISTOR_ARRAY_4CHCRA06S  [RESISTOR_ARRAY_1206_4CH_CRA06S]
R88  0  RESISTORR_0603  [0603]
R89  1  RESISTORR_0805  [0805]
R90  10K  RESISTORR_0805  [0805]
R91  2.2K  RESISTORR_0603  [0603]
R92  1  RESISTORR_0805  [0805]
R93  10K  RESISTORR_0603  [0603]
R94  10K  RESISTORR_0603  [0603]
R95  1  RESISTORR_0805  [0805]
R96  1  RESISTORR_0805  [0805]
R97  22K  RESISTORR_0603  [0603]
R98  RESISTOR_ARRAY_4CHCRA06S  [RESISTOR_ARRAY_1206_4CH_CRA06S]
R99  TRIMPOT3MM-2  [TRIMPOT-3MM-2]
R100  RESISTOR_ARRAY_4CHCRA06S  [RESISTOR_ARRAY_1206_4CH_CRA06S]
R101  DNP  RESISTORR_0603  [0603]
R102  1  RESISTORR_0805  [0805]
R103  22K  RESISTORR_0603  [0603]
R104  100K  RESISTORR_0603  [0603]
R105  39  RESISTORR_0603  [0603]
R106  10K  RESISTORR_0603  [0603]
R107  1  RESISTORR_0805  [0805]
R108  DNP  RESISTORR_0603  [0603]
R109  22  RESISTORR_0805  [0805]
R110  43K  RESISTORR_0603  [0603]
R111  1  RESISTORR_0805  [0805]
R112  22  RESISTORR_0805  [0805]
R113  1  RESISTORR_0805  [0805]
R114  100K  RESISTORR_0603  [0603]
R115  1  RESISTORR_0805  [0805]
R116  100K  RESISTORR_0603  [0603]
R117  RESISTOR_ARRAY_4CHCRA06S  [RESISTOR_ARRAY_1206_4CH_CRA06S]
R118  2.2K  RESISTORR_0603  [0603]
R119  RESISTOR_ARRAY_4CHCRA06S  [RESISTOR_ARRAY_1206_4CH_CRA06S]
R120  2.2K  RESISTORR_0603  [0603]
R121  DNP  RESISTOR_ARRAY_4CHCRA06S  [RESISTOR_ARRAY_1206_4CH_CRA06S]
R122  DNP  RESISTOR_ARRAY_4CHCRA06S  [RESISTOR_ARRAY_1206_4CH_CRA06S]
R123  1K  RESISTORR_0603  [0603]
R124  43K  RESISTORR_0603  [0603]
R125  1  RESISTORR_0805  [0805]
R126  22  RESISTORR_0603  [0603]
R127  1K  RESISTORR_0603  [0603]
R128  10K  RESISTORR_0805  [0805]
R129  43K  RESISTORR_0603  [0603]
R130  22  RESISTORR_0603  [0603]
R131  10K  RESISTORR_0603  [0603]
R132  1K  RESISTORR_0603  [0603]
R133  10K  RESISTORR_0603  [0603]
R134  22K  RESISTORR_0603  [0603]
R135  DNP  RESISTORR_0603  [0603]
R136  22K  RESISTORR_0603  [0603]
R137  100K  RESISTORR_0603  [0603]
R138  39  RESISTORR_0603  [0603]
R139  2.2K  RESISTORR_0603  [0603]
R140  43K  RESISTORR_0603  [0603]
R141  DNP  RESISTORR_0603  [0603]
R142  2.2K  RESISTORR_0603  [0603]
R143  100K  RESISTORR_0603  [0603]
R144  10K  RESISTORR_0603  [0603]
R145  RESISTOR_ARRAY_4CHCRA06S  [RESISTOR_ARRAY_1206_4CH_CRA06S]
R146  100K  RESISTORR_0603  [0603]
R147  TRIMPOT3MM-2  [TRIMPOT-3MM-2]
R148  DNP  RESISTORR_0603  [0603]
R149  10K  RESISTORR_0603  [0603]
R150  DNP  RESISTORR_0603  [0603]
R151  RESISTOR_ARRAY_4CHCRA06S  [RESISTOR_ARRAY_1206_4CH_CRA06S]
R152  330  RESISTORR_0603  [0603]
R153  330  RESISTORR_0603  [0603]
R154  220  RESISTORR_0603  [0603]
R155  220  RESISTORR_0603  [0603]
R156  1M  RESISTORR_0603  [0603]
R157  10K  RESISTORR_0603  [0603]
R158  DNP  RESISTORR_0603  [0603]
R159  100K  RESISTORR_0603  [0603]
R160  390  RESISTORR_0603  [0603]
R161  10K  RESISTORR_0603  [0603]
R162  1K  RESISTORR_0603  [0603]
R163  1  RESISTORR_0805  [0805]
R164  330  RESISTORR_0603  [0603]
R165  10K  RESISTORR_0603  [0603]
R166  562K  RESISTORR_0603  [0603]
R167  10K  RESISTORR_0603  [0603]
R168  10K  RESISTORR_0603  [0603]
R169  10K  RESISTORR_0603  [0603]
R170  DNP  RESISTORR_0603  [0603]
R171  DNP  RESISTORR_0603  [0603]
R172  10K  RESISTORR_0603  [0603]
R173  DNP  RESISTORR_0603  [0603]
R174  68  RESISTORR_0603  [0603]
R175  68  RESISTORR_0603  [0603]
R176  DNP  RESISTORR_0603  [0603]
R177  DNP  RESISTORR_0603  [0603]
R178  330  RESISTORR_0603  [0603]
R179  68  RESISTORR_0603  [0603]
R180  7.5K  RESISTORR_0603  [0603]
R181  22  RESISTORR_0603  [0603]
R182  22  RESISTORR_0603  [0603]
R183  1.5K  RESISTORR_0603  [0603]
R184  7.5K  RESISTORR_0603  [0603]
R185  7.5K  RESISTORR_0603  [0603]
R186  7.5K  RESISTORR_0603  [0603]
R187  1K  RESISTORR_0603  [0603]
R188  DNP  RESISTORR_0603  [0603]
R189  0.006  RESISTOR2512  [2512]
R190  2K  RESISTORR_0603  [0603]
R191  1K  RESISTORR_0603  [0603]
R192  0.006  RESISTOR2512  [2512]
R193  10K  RESISTORR_0603  [0603]
R194  7.5K  RESISTORR_0603  [0603]
R195  7.5K  RESISTORR_0603  [0603]
R196  47K  RESISTORR_0603  [0603]
R197  16  RESISTORR_1206  [1206]
R198  16  RESISTORR_1206  [1206]
R199  47K  RESISTORR_0603  [0603]
R200  8.06K  RESISTORR_0603  [0603]
R201  42.2K  RESISTORR_0603  [0603]
R204  1K  RESISTORR_0603  [0603]
RT1  10K  THERMISTOR0603  [0603]
S8  SWITCH-MOMENTARY-2PTH  [TACTILE-PTH]
SW3  SPST_TACT-KMR2  [KMR2]
SW5  SPST_TACT-KMR2  [KMR2]
U2  ADC128S102  [TSSOP16]
U3  LTC4002S8  [S8_TI]
U4  LDO_EN_FB  [TSOT23]
U5  NJM2068M  [DMP8_NJM]
U6  SN74HCT541TSSOP20  [TSSOP20]
U7  LTC2952F  [TSSOP20_LT]
U8  SN74HCT541TSSOP20  [TSSOP20]
U9  TPA2008D2  [TSSOP24+1_TI]
U10  ADXL345  [LGA14]
U11  NJM2068M  [DMP8_NJM]
U12  WT32  [WT32_BT_MODULE]
U13  USBLC6-2  [SOT23-6L]
U14  NJM2068M  [DMP8_NJM]
U15  TPA6130A2QFN20  [QFN20+1]
U16  SN74HCT541TSSOP20  [TSSOP20]
U17  NJM2068M  [DMP8_NJM]
U18  TS5A22364DGS  [MSOP10]
U19  ATMEGA32U4AU  [TQFP44]
U20  TS5A22364DGS  [MSOP10]
U21  FLASH-SPI-25XXSMD1  [SO08-EIAJ]
U22  6N138SMD8  [SMD-8]
U23  LT3971  [MSOP10+1_LT]
U24  LDO_EN_FB  [TSOT23]
U25  LDO_EN_FB  [TSOT23]
U26  FLASH-SPI-25XXSMD1  [SO08-EIAJ]
U27  6SLX9TQG144  [TQ144]
U28  FT2232D  [LQFP48]
U29  93C46B  DIGITAL-EEPROM-MICROWIRE-6P_SOT23  [SOT23-6]
U30  LTC3891  [TSSOP20+1_LT]
X1  16Mhz  ABRACOM_CLOCKS_ABABM10  [ABRACOM_CLOCK]
X2  ABRACOM_CLOCKS_ABABM10  [ABRACOM_CLOCK]
~NUDEV~  GND-GNDA  [GND-GNDA]

### Nets
1V2: C89.1 C90.1 C91.1 C92.1 U27.19(BVCCINT:VCCINT) U27.28(BVCCINT:VCCINT) U27.52(BVCCINT:VCCINT) U27.89(BVCCINT:VCCINT) U27.128(BVCCINT:VCCINT)
3V3: C85.1 C86.1 C87.1 C88.1 C93.1 C94.1 C95.1 C96.1 C97.1 C98.1 C99.1 C100.1 IC2.1(VDD) IC2.3(VDDQ) IC2.9(VDDQ) IC2.14(VDD) IC2.27(VDD) IC2.43(VDDQ) IC2.49(VDDQ) OSC.1@1(OE) OSC.4@4(VCC) R199.2 U26.3(WP) U26.7(HOLD) U26.8(VCC) U27.4(B3:VCCO_3) U27.18(B3:VCCO_3) U27.20(BVCCAUX:VCCAUX) U27.31(B3:VCCO_3) U27.36(BVCCAUX:VCCAUX) U27.42(B2:VCCO_2) U27.53(BVCCAUX:VCCAUX) U27.63(B2:VCCO_2) U27.69(B2:IO_L1N_M0_CMPMISO_2) U27.76(B1:VCCO_1) U27.86(B1:VCCO_1) U27.90(BVCCAUX:VCCAUX) U27.103(B1:VCCO_1) U27.122(B0:VCCO_0) U27.125(B0:VCCO_0) U27.129(BVCCAUX:VCCAUX) U27.135(B0:VCCO_0)
3V3OUT_A: C142.2 U28.6(3V3OUT)
!CAS: IC2.17(!CAS) U27.5(B3:IO_L52N_3)
!RAS: IC2.18(!RAS) U27.2(B3:IO_L83P_3)
!WE: IC2.16(!WE) U27.6(B3:IO_L52P_3)
+3V3: C54.1 C57.1 C58.1 C59.P$1 C106.1 C107.1 C108.1 C127.1 C128.P$1 C129.1 C132.P$2(+) C133.P$1 C134.1 C135.P$1 C138.1 D9.1(A) D14.1(A) J2.2 JP16.5 JP39.6 L2.1 L14.P$2 LED1.1(A) LED2.1(A) R74.2 R75.P$4 R131.2 R155.2 R156.2 R171.2 U10.1(VDD) U10.6(VSS) U10.7(CS) U12.17(VDDIO) U12.37(VDD_BAT) U19.14(VCC) U19.24(AVCC) U19.34(VCC) U19.44(AVCC) U21.3(WP) U21.7(HOLD) U21.8(VCC) U22.P$8(VCC) U23.P$1(BD) U24.1(IN) U25.5(OUT) U28.10(SI/WUA) U28.14(VCCIOA) U28.26(SI/WUB) U28.31(VCCIOB)
+5V: C18.1 C30.1 C31.1 C32.P$2 C33.P$2 C37.P$2 C41.P$2 C42.P$1 C43.1 C44.1 C52.1 C53.1 C55.P$2 C60.P$2 C68.P$2 C103.P$1 C104.1 C105.P$2 C111.P$2 C114.P$2 C123.P$2 C139.1 C140.1 C144.+ C145.+ C146.+ C147.+ C148.P$1 C149.P$1 C150.P$1 C151.P$1 C152.P$1 C153.P$1 C154.P$1 C155.P$1 C156.P$1 C157.P$1 C158.P$1 C159.P$1 C160.P$1 C161.P$1 C162.P$1 C163.P$1 C164.1 C169.1 C185.P$2(+) C186.P$2(+) C187.P$2(+) C188.P$2(+) C189.P$2(+) C190.P$2(+) C191.P$1 C192.P$1 C193.P$1 C194.P$1 C195.P$1 C196.P$1 C197.P$1 C198.P$1 C199.P$1 IC1.3(2_VIN) JP4.4 JP7.4 JP11.4 JP12.4 JP14.4 JP18.4 JP21.4 JP24.4 JP27.4 JP29.4 JP33.4 JP34.4 R23.2 R31.P$6 R31.P$7 R31.P$8 R33.2 R62.1 R65.1 R135.2 R152.2 R153.2 R180.1 R189.1 R191.2 R192.1 R193.1 R198.P$1 R200.2 U4.1(IN) U6.20(VCC) U8.20(VCC) U9.4(PVDDL) U9.9(PVDDL) U9.13(VDD) U9.16(PVDDR) U9.21(PVDDR) U16.20(VCC) U25.1(IN) U28.3(VCC) U28.4(RESET#) U28.42(VCC) U29.6(VCC)
_KILL: JP9.3 U7.P$3(_KILL)
A0: IC2.23(A0) U27.140(B0:IO_L3P_0)
A1: IC2.24(A1) U27.139(B0:IO_L3N_0)
A2: IC2.25(A2) U27.138(B0:IO_L4P_0)
A3: IC2.26(A3) U27.137(B0:IO_L4N_0)
A4: IC2.29(A4) U27.46(B2:IO_L49P_D3_2)
A5: IC2.30(A5) U27.45(B2:IO_L49N_D4_2)
A6: IC2.31(A6) U27.44(B2:IO_L62P_D5_2)
A7: IC2.32(A7) U27.43(B2:IO_L62N_D6_2)
A8: IC2.33(A8) U27.41(B2:IO_L64P_D8_2)
A9: IC2.34(A9) U27.40(B2:IO_L64N_D9_2)
A10: IC2.22(A10) U27.141(B0:IO_L2N_0)
A11: IC2.35(A11) U27.35(B3:IO_L1P_3)
A12: IC2.36(A12) U27.34(B3:IO_L1N_VREF_3)
ACC_INT1: JP15.P$1 U10.8(INT1)
ACC_INT2: JP15.P$2 U10.9(INT2)
ADC_CS: R8.P$8
ADC_IN2: C5.2 R1.1 R13.2
ADC_IN3: C6.2 R2.1 R14.2
ADC_IN4: C7.2 R3.P$1 R15.P$8 U2.7(IN3)
ADC_IN5: C8.2 R3.P$2 R15.P$7 U2.6(IN2)
ADC_IN6: C9.2 R3.P$3 R15.P$6 U2.5(IN1)
ADC_IN7: C10.2 R3.P$4 R15.P$5 U2.4(IN0)
ADC_MISO: R8.P$6
ADC_MOSI: R8.P$7
ADC_SCK: R8.P$5
AOL_N: R89.2 U18.4(NC1)
AOL_P: R92.2 U18.8(NC2)
AOR_N: R95.2 U20.4(NC1)
AOR_P: R96.2 U20.8(NC2)
AREF: C124.1 R135.1 R141.2 U19.42(AREF)
ATMEGA_MISO: U19.11(PB3(MISO))
ATMEGA_MOSI: U19.10(PB2(MOSI))
ATMEGA_SCK: U19.9(PB1(SCK))
AUX_IN_L: C56.1 JP26.TIP R9.1
AUX_IN_L_N: R115.2 U18.2(N01)
AUX_IN_L_P: R69.2 U18.10(N02)
AUX_IN_R: C112.1 JP26.RING R10.1
AUX_IN_R_N: R163.2 U20.2(N01)
AUX_IN_R_P: R125.2 U20.10(N02)
AUX_OUT_L: C116.P$2 JP28.TIP R6.1 R109.2 R137.2 R138.2
AUX_OUT_R: C77.P$2 JP28.RING R7.1 R104.2 R105.2 R112.2
BA0: IC2.20(BA0) U27.143(B0:IO_L1N_VREF_0)
BA1: IC2.21(BA1) U27.142(B0:IO_L2P_0)
BT_CLK: JP19.4 U12.33(SPI_CLK)
BT_CTS: JP16.1 R75.P$8
BT_MIC_BIAS: R20.2 U12.40(MIC_BIAS)
BT_MISO: JP19.3 U12.34(SPI_MISO)
BT_MOSI: JP19.2 U12.35(SPI_MOSI)
BT_PIO2: R98.P$4
BT_PIO3: R98.P$3
BT_PIO9: R87.P$1
BT_PIO10: R87.P$2
BT_RTS: JP16.2 R75.P$7
BT_RXD: R87.P$3
BT_SPICS: JP19.5 U12.32(SPI_CS)
BT_TXD: R87.P$4
BUFFER_EN: R33.1 R44.2 U6.1(OE1) U6.19(OE2) U8.1(OE1) U8.19(OE2) U16.1(OE1) U16.19(OE2)
C4: R160.2
CKE: IC2.37(CKE) U27.33(B3:IO_L2P_3)
CLK: IC2.38(CLK) U27.32(B3:IO_L2N_3)
CS: IC2.19(\CS) U27.1(B3:IO_L83N_VREF_3)
D+: JP30.D+ R130.2 R177.2 U13.1(IO1A)
D+1: JP40.D+ R177.1 R182.1
D+_IC: R126.1 U19.3(D-)
D-: JP30.D- R126.2 R176.2 U13.3(IO2A)
D-1: JP40.D- R176.1 R181.1
D-_IC: R130.1 U19.4(D+)
DO_A: R190.1 R193.2 U29.1(DO)
DQ0: IC2.2(DQ0) U27.9(B3:IO_L50N_3)
DQ1: IC2.4(DQ1) U27.10(B3:IO_L50P_3)
DQ2: IC2.5(DQ2) U27.11(B3:IO_L49N_3)
DQ3: IC2.7(DQ3) U27.12(B3:IO_L49P_3)
DQ4: IC2.8(DQ4) U27.14(B3:IO_L44N_GCLK20_3)
DQ5: IC2.10(DQ5) U27.15(B3:IO_L44P_GCLK21_3)
DQ6: IC2.11(DQ6) U27.16(B3:IO_L43N_GCLK22_IRDY2_3)
DQ7: IC2.13(DQ7) U27.8(B3:IO_L51P_3)
DQ8: IC2.42(DQ8) U27.21(B3:IO_L42N_GCLK24_3)
DQ9: IC2.44(DQ9) U27.22(B3:IO_L42P_GCLK25_TRDY2_3)
DQ10: IC2.45(DQ10) U27.23(B3:IO_L41N_GCLK26_3)
DQ11: IC2.47(DQ11) U27.24(B3:IO_L41P_GCLK27_3)
DQ12: IC2.48(DQ12) U27.26(B3:IO_L37N_3)
DQ13: IC2.50(DQ13) U27.27(B3:IO_L37P_3)
DQ14: IC2.51(DQ14) U27.29(B3:IO_L36N_3)
DQ15: IC2.53(DQ15) U27.30(B3:IO_L36P_3)
DQMH: IC2.39(DQMH) U27.17(B3:IO_L43P_GCLK23_3)
DQML: IC2.15(DQML) U27.7(B3:IO_L51N_3)
EECS_A: U28.48(EECS) U29.5(CS)
EEDATA_A: R190.2 U28.2(EEDATA) U29.3(DI)
EESK: U28.1(EESK) U29.4(CLK)
EN: R45.1 U7.P$14(EN)
FILTERED_VCC_A: C141.2 R191.1 U28.46(AVCC)
FLASH_CS: U21.1(CS) U26.1(CS) U27.38(B2:IO_L65N_CSO_B_2)
FLASH_MISO: U21.2(MISO)
FLASH_MOSI: U21.5(MOSI)
FLASH_SCK: U21.6(SCK) U26.6(SCK) U27.70(B2:IO_L1P_CCLK_2)
FLASH_SI: U26.5(MOSI) U27.64(B2:IO_L3N_MOSI_CSI_B_MISO0_2)
FLASH_SO: U26.2(MISO) U27.65(B2:IO_L3P_D0_DIN_MISO_MISO1_2)
GND: $2.1 C1.2 C2.2 C3.2 C4.2 C11.2 C12.P$2 C13.P$2 C14.2 C15.2 C19.P$1(-) C20.P$2 C21.2 C30.2 C31.2 C32.P$1 C33.P$1 C37.P$1 C38.2 C39.2 C41.P$1 C52.2 C53.2 C54.2 C55.P$1 C57.2 C58.2 C59.P$2 C60.P$1 C68.P$1 C85.2 C86.2 C87.2 C88.2 C89.2 C90.2 C91.2 C92.2 C93.2 C94.2 C95.2 C96.2 C97.2 C98.2 C99.2 C100.2 C103.P$2 C104.2 C105.P$1 C106.2 C107.2 C108.2 C109.2 C111.P$1 C113.2 C114.P$1 C120.2 C121.2 C123.P$1 C124.2 C127.2 C128.P$2 C130.P$2 C131.2 C132.P$1(-) C133.P$2 C134.2 C135.P$2 C136.2 C137.2 C138.2 C139.2 C140.2 C141.1 C142.1 C143.2 C144.- C145.- C146.- C147.- C148.P$2 C149.P$2 C150.P$2 C151.P$2 C152.P$2 C153.P$2 C154.P$2 C155.P$2 C156.P$2 C157.P$2 C158.P$2 C159.P$2 C160.P$2 C161.P$2 C162.P$2 C163.P$2 C164.2 C165.1 C166.2 C167.2 C168.1 C169.2 C172.P$2 C173.P$2 C174.P$2 C175.P$2 C176.P$2 C177.P$2 C178.P$2 C179.P$1(-) C180.P$1(-) C181.P$1(-) C185.P$1(-) C186.P$1(-) C187.P$1(-) C188.P$1(-) C189.P$1(-) C190.P$1(-) C191.P$2 C192.P$2 C193.P$2 C194.P$2 C195.P$2 C196.P$2 C197.P$2 C198.P$2 C199.P$2 D3.P$2(A) D13.P$2(A) D17.A IC1.1(1_GND) IC2.6(VSSQ) IC2.12(VSSQ) IC2.28(VSS) IC2.41(VSS) IC2.46(VSSQ) IC2.52(VSSQ) IC2.54(VSS) J1.GND J1.GNDBREAK J2.6 JP1.1 JP2.1 JP4.1 JP7.1 JP9.1 JP11.1 JP12.1 JP14.1 JP15.P$3 JP18.1 JP19.1 JP21.1 JP24.1 JP27.1 JP29.1 JP30.GND JP33.1 JP34.1 JP36.1 JP37.P$4 JP39.5 JP40.GND JP41.P$1 LED3.2(C) OSC.2@2(GND) Q7.1S(S) Q7.2S(S) Q7.3S(S) R13.1 R14.1 R15.P$1 R15.P$2 R15.P$3 R15.P$4 R17.2 R35.1 R42.P$1 R42.P$2 R42.P$3 R42.P$4 R43.P$1 R43.P$2 R43.P$3 R43.P$4 R44.1 R54.1 R55.1 R72.P$1 R72.P$2 R72.P$3 R72.P$4 R73.P$1 R73.P$2 R73.P$3 R73.P$4 R90.2 R121.P$1 R121.P$2 R121.P$3 R121.P$4 R122.P$1 R122.P$2 R122.P$3 R122.P$4 R123.2 R127.2 R132.2 R141.1 R164.1 R165.1 R166.1 R168.1 R169.1 R170.1 R173.1 R178.1 RT1.2 S8.1 SW3.2(S) SW3.4(S1) SW5.2(S) SW5.4(S1) U2.3(AGND) U2.12(DGND) U3.P$4(GND) U6.10(GND) U7.P$12(GND) U8.10(GND) U9.6(PGNDL) U9.7(PGNDL) U9.18(PGNDR) U9.19(PGNDR) U10.2(GND) U10.4(GND) U10.5(GND) U10.12(SDO) U12.2(DGND) U12.3(DGND) U12.4(DGND) U12.18(DGND) U12.31(DGND) U13.2(GND) U16.10(GND) U19.5(UGND) U19.15(GND) U19.23(GND) U19.35(GND) U19.43(GND) U21.4(GND) U22.P$5(GND) U23.P$11(GND) U24.2(GND) U25.2(GND) U26.4(GND) U27.3(BGND:GND) U27.13(BGND:GND) U27.25(BGND:GND) U27.49(BGND:GND) U27.54(BGND:GND) U27.60(B2:IO_L13P_M1_2) U27.68(BGND:GND) U27.73(BNA:SUSPEND) U27.77(BGND:GND) U27.91(BGND:GND) U27.96(BGND:GND) U27.108(BGND:GND) U27.113(BGND:GND) U27.130(BGND:GND) U27.136(BGND:GND) U27.144(B0:IO_L1P_HSWAPEN_0) U28.9(GND) U28.18(GND) U28.25(GND) U28.34(GND) U28.45(GND) U28.47(TEST) U29.2(GND) U30.P$11(PGND) X1.2 X1.4 X2.2 X2.4
GNDA: C17.2 C18.2 C24.1 C26.2 C27.2 C28.2 C29.2 C40.2 C42.P$2 C43.2 C44.2 C50.2 C51.2 C61.2 C62.2 C64.2 C65.2 C73.2 C74.2 C75.2 C84.2 C102.2 C122.2 C125.2 JP3.SLEEVE JP8.1 JP20.1 JP26.SLEEVE JP28.SLEEVE JP31.P$1 MIC2.1 R26.1 R27.1 R58.1 R59.1 R68.3(CW) R71.1 R76.1 R77.1 R104.1 R106.1 R116.1 R137.1 R146.1 R149.1 U4.2(GND) U5.4(A:V-) U9.12(AGND) U9.PGND(AGND) U11.4(A:V-) U12.39(AGND) U12.43(AGND) U12.48(AGND) U14.4(A:V-) U15.P$3(GND) U15.P$9(GND) U15.P$10(GND) U15.P$13(GND) U15.P$19(GND) U15.PAD(GND) U17.4(A:V-) U18.6(GND) U20.6(GND)
GNDIO: C171.2 C182.2 C183.2 C184.2 C201.2 R188.1 R195.1 R201.1 U30.P$4(SGND) U30.P$5(SGND) U30.PAD(SGND)
LED1: R196.2 U27.112(B0:IO_L66P_SCP1_0)
LED_B1: U19.30(PB6(D10*/A11))
LED_G1: U19.31(PC6(D5*))
LED_R1: U19.32(PC7(D13*))
LOUT_N: C45.1 C78.1 C80.1 U18.3(COM1)
LOUT_P: C46.1 C76.1 C81.1 U18.9(COM2)
MIC_DYNAMIC: R4.1 R66.2 U5.7(B:OUT)
MIC_ELECTRET: C22.2 R5.1 R19.2 U5.1(A:OUT)
MIC_N: C25.1 C28.1 C69.2 L5.1
MIC_P: C23.1 C29.1 C70.2 L4.1
MIC_REG: C17.1 R30.2 R84.2 U4.5(OUT)
MISO: J2.1
MOSI: J2.4
MUX_IN1: JP31.P$2 R145.P$5 R145.P$6 R145.P$7 R145.P$8 U19.12(PB7(D11*))
N$1: C120.1 U19.16(XTAL2) X1.3(3A)
N$2: C35.1 R50.2 R52.2 U5.5(B:+)
N$3: C5.1 R4.2
N$4: C36.1 R40.1 R50.1 R53.1 R59.2
N$5: U19.40(PF1(ADC1))
N$6: R94.2 U15.P$6(SD)
N$7: D11.2(C) R132.1
N$8: C112.2 R128.1
N$9: R20.1 R23.1 U4.3(EN)
N$10: C56.2 R70.1
N$11: R96.1 U12.47(AUDIO_OUT_P_RIGHT)
N$12: C121.1 U19.17(XTAL1) X1.1(1A)
N$13: C26.1 R21.1 R25.2 R26.2 U5.3(A:+)
N$14: R123.1 U19.33(PE2(HWB))
N$15: L3.P$2 R18.P$2 U3.P$7(SENSE)
N$15_A: R183.2 U28.5(RSTOUT#)
N$16: U19.41(PF0(ADC0/INT6))
N$17: R36.2 U7.P$19(G1)
N$19: C45.2 L6.1
N$20: C113.1 U19.6(UCAP)
N$21: D2.1(A) R11.1
N$22: C46.2 L7.1
N$23: C47.2 L8.1
N$24: C48.2 L9.1
N$25: R77.2 U9.11(ROSC)
N$26: C62.1 U9.10(COSC)
N$27: C7.1 R6.2
N$28: C49.P$1 C50.1 JP13.1 L10.P$2
N$29: U19.29(PB5(D9*/A10))
N$30: Q4.1(G) Q5.1(G) R36.1
N$31: L10.P$1 U9.8(LOUTN)
N$32: C61.1 U9.22(BYPASS)
N$33: L11.P$1 U9.5(LOUTP)
N$34: C49.P$2 C51.1 JP13.2 L11.P$2
N$35: L13.P$1 U9.20(ROUTP)
N$36: L12.P$1 U9.17(ROUTN)
N$37: C63.P$1 C64.1 JP17.2 L12.P$2
N$38: C63.P$2 C65.1 JP17.1 L13.P$2
N$39: JP36.3 R151.P$6
N$40: JP36.2 R151.P$5
N$41: Q2.1(G) Q3.1(G) U7.P$15(G2)
N$42: R29.1 R35.2 R41.1 U7.P$5(PFI)
N$44: L9.2 U9.23(RINP)
N$45: U2.8(IN4)
N$49: U2.9(IN5)
N$50: U2.10(IN6)
N$51: U2.11(IN7)
N$53: L8.2 U9.24(RINN)
N$54: L7.2 U9.2(LINP)
N$55: L6.2 U9.1(LINN)
N$75: C27.1 JP3.RING L5.2 MIC1.1 R27.2
N$76: C24.2 JP3.TIP L4.2 MIC1.2 R22.1 R30.1
N$77: C69.1 U12.44(AUDIO_IN_P_LEFT)
N$78: C70.1 U12.45(AUDIO_IN_N_LEFT)
N$80: S8.3 U7.P$7(_PB)
N$81: R48.1 R55.2 U7.P$1(M2)
N$82: $2.2 R47.1 U7.P$2(M1)
N$83: R80.1 U12.36(LED0)
N$84: Q1.4(.2:G) U3.P$3(GATE)
N$85: C13.P$1 C14.1 C15.1 D1.P$1(C) Q1.1(.1:S) Q1.3(.2:S) U3.P$2(VCC)
N$86: U19.39(PF4(ADC4))
N$87: R98.P$5 U12.9(PIO2)
N$88: C23.2 R24.1
N$89: C16.1 U3.P$1(COMP)
N$90: C16.2 R17.1
N$92: RT1.1 U3.P$8(NTC)
N$93: D3.P$1(C) L3.P$1 Q1.5(.2:D) Q1.6(.2:D)
N$94: R98.P$6 U12.10(PIO3)
N$95: R87.P$8 U12.13(PIO9)
N$97: R87.P$7 U12.14(PIO10)
N$99: R95.1 U12.46(AUDIO_OUT_N_RIGHT)
N$100: D9.2(C) R80.2
N$101: C67.2 R61.2 R78.2 R91.2 R108.2 R115.1 U11.7(B:OUT)
N$103: R92.1 U12.50(AUDIO_OUT_P_LEFT)
N$104: R98.P$1 U13.4(IO2B)
N$105: JP16.4 R75.P$5
N$106: C39.1 U7.P$11(OFFT)
N$109: JP16.3 R75.P$6
N$110: R98.P$8 U12.12(USB_DP)
N$111: R98.P$7 U12.11(USB_DN)
N$113: C25.2 R25.1
N$115: JP36.5 R151.P$8
N$116: C38.1 U7.P$10(ONT)
N$117: D5.1(A) R31.P$2
N$118: D7.1(A) R31.P$3
N$119: Q2.3(S) Q3.3(S)
N$120: D6.1(A) R31.P$1
N$121: D5.2(C) U7.P$8(_RST)
N$122: LED3.1(A) R196.1
N$125: JP40.ID
N$129: C126.2 D13.P$1(C) L14.P$1 U23.P$3(SW)
N$130: D6.2(C) U7.P$20(G1STAT)
N$131: R87.P$6 U12.15(RXD)
N$132: R87.P$5 U12.16(TXD)
N$133: D7.2(C) U7.P$9(_PFO)
N$134: C22.1 R19.1 R24.2 U5.2(A:-)
N$135: JP9.4 U7.P$13(_INT)
N$136: R49.2 U7.P$18(V1)
N$137: R51.2 U7.P$16(V2)
N$138: C126.1 U23.P$2(BOOST)
N$139: R98.P$2 U13.6(IO1B)
N$140: C101.2 R113.1
N$141: C83.2 R111.1
N$142: C81.2 R107.1
N$143: C78.2 R102.1
N$144: R102.2 U15.P$1(LEFTINM)
N$145: R107.2 U15.P$2(LEFTINP)
N$146: R75.P$1 U12.21(CTS)
N$147: R75.P$2 U12.20(RTS)
N$148: R111.2 U15.P$5(RIGHTINM)
N$149: R113.2 U15.P$4(RIGHTIMP)
N$150: R74.1 R79.2 U12.1(VREG_ENA)
N$151: C35.2 C36.2
N$152: C73.1 U15.P$15(CPVSS) U15.P$16(CPVSS)
N$153: R109.1 U15.P$14(HPLEFT)
N$154: C79.1 U15.P$18(CPP)
N$155: C79.2 U15.P$17(CPN)
N$156: D8.ANNODE(1)(A) R79.1
N$157: R112.1 U15.P$11(HPRIGHT)
N$159: C34.2 R52.1
N$160: C6.1 R5.2
N$161: R172.2 U25.3(EN)
N$162: C34.1 JP8.2 MIC2.2 R37.1 R38.1 R39.1 R58.2
N$163: R57.1 U5.6(B:-)
N$164: R89.1 U12.49(AUDIO_OUT_N_LEFT)
N$165: C117.2 R118.2 R133.2 R142.2 R150.2 R163.1 U17.7(B:OUT)
N$166: R120.2 R125.1 R139.2 U17.1(A:OUT)
N$167: C40.1 R60.1
N$168: R57.2 R60.2 R66.1
N$169: JP6.P$1 R40.2
N$170: R75.P$3 U12.19(RESET)
N$171: LED1.2(C) R187.2
N$172: R171.1 R173.2 U25.4(FB)
N$173: D14.2(C) R162.2
N$174: Q4.3(S) Q5.3(S)
N$175: R162.1 U23.P$9(PG)
N$176: D2.2(C) Q1.2(.1:G) R12.1 U3.P$5(CHRG)
N$177: R100.P$8 U12.27(PCM_IN)
N$179: R158.1 R170.2 U24.4(FB)
N$180: C129.2 R156.1 R166.2 U23.P$6(FB)
N$181: R100.P$7 U12.28(PCM_OUT)
N$182: C66.1 JP22.2 R81.1 R97.2 R99.2(WIPER) U14.2(A:-)
N$183: C82.1 R103.2 R110.2 U14.3(A:+)
N$184: C76.2 R97.1
N$185: C80.2 R103.1
N$186: C71.1 U12.41(AUDIO_IN_P_RIGHT)
N$187: C72.1 U12.42(AUDIO_IN_N_RIGHT)
N$188: C66.2 C77.P$1 R81.2 R83.2 U14.1(A:OUT)
N$189: C82.2 C102.1 R110.1 R114.1 R116.2
N$190: C84.1 R105.1
N$191: R167.2 U24.3(EN)
N$192: R165.2 U23.P$10(SYNC)
N$193: JP32.2 R129.1 R147.2(WIPER)
N$194: C119.1 R136.2 R140.2 U14.5(B:+)
N$195: C115.2 R134.1
N$196: C118.2 R136.1
N$197: C137.1 R159.1
N$198: R139.1 R142.1 U17.6(B:-)
N$199: C110.2 C116.P$1 R124.2 R129.2 U14.7(B:OUT)
N$200: C119.2 C125.1 R140.1 R143.1 R146.2
N$201: R169.2 U23.P$8(RT)
N$202: C122.1 R138.1
N$203: JP5.P$1 R38.2
N$204: R100.P$6 U12.29(PCM_SYNC)
N$205: R159.2 U23.P$7(SS)
N$206: R145.P$4 U18.5(IN1)
N$209: R145.P$3 U18.7(IN2)
N$210: R100.P$5 U12.30(PCM_CLK)
N$211: R100.P$4
N$212: R157.1 R161.2 R168.2 U23.P$5(EN)
N$213: LED2.2(C) R204.2
N$214: R100.P$3
N$215: JP37.P$2 JP38.5(MIDI_OUT) R154.1
N$216: R100.P$2
N$217: JP36.4 R151.P$7
N$218: R145.P$2 U20.5(IN1)
N$219: R145.P$1 U20.7(IN2)
N$220: R100.P$1
N$221: D12.C R153.1 R154.2 R164.2 U22.P$2(A)
N$222: R118.1 R120.1 U17.2(A:-)
N$223: R85.1 R91.1 U11.6(B:-)
N$224: C117.1 R128.2 R133.1 U17.3(A:+)
N$225: JP35.P$1 R148.1
N$226: C8.1 R7.2
N$227: R144.1 R148.2 R149.2 R150.1 U17.5(B:+)
N$228: D12.A JP37.P$1 JP38.4(MIDI_IN) R152.1 R178.2 U22.P$3(C)
N$229: JP22.1 R83.1 R99.3(CW)
N$230: R61.1 R64.1 U11.2(A:-)
N$231: C67.1 R70.2 R78.1 U11.3(A:+)
N$232: R155.1 R160.1 U22.P$6(VO)
N$233: C72.2 JP23.1 R90.1
N$234: R93.1 R101.2 R106.2 R108.1 U11.5(B:+)
N$235: JP25.P$1 R101.1
N$236: C71.2 JP23.2 R84.1
N$238: C110.1 JP32.1 R124.1 R134.2 R147.3(CW) U14.6(B:-)
N$250: R32.P$1 U6.14(Y5)
N$251: R28.P$1 U6.18(Y1)
N$252: R28.P$2 U6.17(Y2)
N$253: R28.P$3 U6.16(Y3)
N$254: R28.P$4 U6.15(Y4)
N$255: R32.P$2 U6.13(Y6)
N$256: R32.P$3 U6.12(Y7)
N$257: R32.P$4 U6.11(Y8)
N$258: JP11.2 R32.P$8
N$259: JP11.3 R32.P$7
N$260: JP7.3 R28.P$5
N$261: JP7.2 R28.P$6
N$262: JP4.3 R28.P$7
N$263: JP4.2 R28.P$8
N$269: C3.1 C4.1 L2.2 U2.13(VD)
N$271: C1.1 C2.1 L1.2 U2.2(VA)
N$273: D10.2(C) R127.1
N$283: R82.P$1 U8.14(Y5)
N$284: R63.P$1 U8.18(Y1)
N$285: R63.P$2 U8.17(Y2)
N$286: R63.P$3 U8.16(Y3)
N$287: R63.P$4 U8.15(Y4)
N$288: R82.P$2 U8.13(Y6)
N$289: R82.P$3 U8.12(Y7)
N$290: R82.P$4 U8.11(Y8)
N$291: JP21.2 R82.P$8
N$292: JP21.3 R82.P$7
N$293: JP18.3 R63.P$5
N$294: JP18.2 R63.P$6
N$295: JP14.3 R63.P$7
N$296: JP14.2 R63.P$8
N$300: R64.2 R69.1 R85.2 U11.1(A:OUT)
N$330: R119.P$1 U16.14(Y5)
N$331: R117.P$1 U16.18(Y1)
N$332: $3.P$1 C170.2 D17.C Q6.1S(S) Q6.2S(S) Q6.3S(S) Q7.PAD2(D) Q7.PAD(D) U30.P$13(SW)
N$334: R117.P$2 U16.17(Y2)
N$335: R117.P$3 U16.16(Y3)
N$336: C171.1
N$337: C182.1 R194.2 U30.P$10(ITH)
N$338: C200.1 R197.P$2 U30.P$8(SENSE+)
N$339: C200.2 R198.P$2 U30.P$7(SENSE-)
N$340: $3.P$2 R189.2 R192.2 R197.P$1
N$341: C167.1 D16.P$2(A) R16.2 U30.P$16(INTVCC)
N$342: R117.P$4 U16.15(Y4)
N$343: R119.P$2 U16.13(Y6)
N$344: R119.P$3 U16.12(Y7)
N$345: R119.P$4 U16.11(Y8)
N$346: JP33.2 R119.P$8
N$347: JP33.3 R119.P$7
N$348: JP29.3 R117.P$5
N$349: JP29.2 R117.P$6
N$350: JP27.2 R117.P$8
N$351: JP12.2 R32.P$6
N$352: C184.1 U30.P$1(TRACK/SS)
N$353: R195.2 U30.P$2(FREQ)
N$354: C183.1 R194.1
N$355: Q7.4G(G) U30.P$15(BG)
N$356: Q6.4G(G) U30.P$12(TG)
N$357: C170.1 D16.P$1(C) U30.P$14(BOOST)
N$358: C201.1 R200.1 R201.2 U30.P$9(VFB)
N$359: R185.2 U30.P$6(RUN)
N$360: D15.2(C) R184.1
N$361: R16.1 R188.2 U30.P$3(PLLIN/MODE)
N$362: R186.2 U30.P$20(ILIM)
N$363: R186.1
N$365: C166.1 R180.2 U30.P$17(EXTVCC)
N$366: JP12.3 R32.P$5
N$367: JP24.2 R82.P$6
N$368: JP24.3 R82.P$5
N$369: JP34.2 R119.P$6
N$370: JP34.3 R119.P$5
N$373: JP27.3 R117.P$7
N$381: R88.2 U15.P$8(SCL)
N$382: R86.2 U15.P$7(SDA)
N$384: R8.P$4 U2.16(SCLK)
N$385: R8.P$2 U2.14(DIN)
N$386: R8.P$1 U2.1(CS)
N$387: R8.P$3 U2.15(DOUT)
N$395: C10.1 R10.2
N$396: C9.1 R9.2
N$412: R204.1 U28.27(BCBUS3)
N$413: R187.1 U28.28(BCBUS2)
OSC_IN: OSC.3@3(OUT) U27.94(B1:IO_L40N_GCLK10_1)
PGOOD: R184.2 U30.P$18(PGOOD)
PWR_DOWN: JP10.P$1 R34.2 R45.2 R56.2 R161.1 R167.1 R172.1 R185.1
REBOOT: JP41.P$2 R199.1 SW3.1(P) SW3.3(P1) U27.37(B2:PROGRAM_B_2)
RESET: J2.5 R131.1 SW5.1(P) SW5.3(P1) U19.13(_RESET)
ROT1_A: R151.P$1 U19.25(PD4(D4/A6))
ROT1_B: R151.P$2 U19.26(PD6(D12/A7))
ROT2_A: R151.P$3 U19.1(PE6(D7)) U19.27(PD7(D6*/A8))
ROT2_B: R151.P$4 U19.28(PB4(D8/A9))
ROUT_N: C47.1 C83.1 C118.1 U20.3(COM1)
ROUT_P: C48.1 C101.1 C115.1 U20.9(COM2)
RXD: U19.20(PD2(INT2/RXD1/D0))
RXLED: D10.1(A) U19.8(PB0(SS){RXLED})
SCK: J2.3
SCL: R88.1 U19.18(PD0(INT0/SCL/D3))
SCL_B: U10.14(SCL)
SDA: R86.1 U19.19(PD1(INT1/SDA/D2))
SDA_B: U10.13(SDA)
SHUTDOWN: D8.CATHODE(2)(C) JP10.P$2 R56.1 R67.1 R94.1
TCK: JP39.4 R174.2 U27.109(BNA:TCK)
TDI: JP39.2 R175.2 U27.110(BNA:TDI)
TDO: JP39.3 U27.106(BNA:TDO) U28.22(ADBUS2)
TMS: JP39.1 R179.2 U27.107(BNA:TMS)
TPA2008_EN: R65.2 R67.2 R76.2 U9.3(_SHTDN)
TPA2008_VOL: JP20.2 R62.2 R68.2(WIPER) R71.2 U9.14(VOLUME)
TXD: U19.21(PD3(INT3/TXD1/D1))
TXLED: D11.1(A) U19.22(PD5(TXLED))
USB_ID: JP30.ID
USB_RXD: U27.105(B1:IO_L1P_1) U28.39(BDBUS1)
USB_TCK: R174.1 U28.24(ADBUS0)
USB_TDI: R175.1 U28.23(ADBUS1)
USB_TMS: R179.1 U28.21(ADBUS3)
USB_TXD: U27.101(B1:IO_L32N_1) U28.40(BDBUS0)
USBDM_A: R181.2 U28.8(USBDM)
USBDP_A: R182.2 R183.1 U28.7(USBDP)
VBATT: C19.P$2(+) C20.P$1 C21.1 JP1.2 Q4.2/HEAT(D) R18.P$1 R46.2 R47.2 R49.1 U3.P$6(BATT)
VBUS: C109.1 C143.1 D4.P$2(A) JP30.VBUS JP40.VBUS U13.5(VBUS) U19.2(UVCC) U19.7(VBUS)
VCCIO: C74.1 C75.1 IC1.2/HEAT(3_OUT) L1.1 R1.2 R2.2 R3.P$5 R3.P$6 R3.P$7 R3.P$8 R21.2 R22.2 R37.2 R53.2 R93.2 R114.2 R143.2 R144.2 U5.8(A:V+) U11.8(A:V+) U14.8(A:V+) U15.P$12(VDD) U15.P$20(VDD) U17.8(A:V+) U18.1(VCC) U20.1(VCC)
VDD: C136.1 R158.2 U24.5(OUT)
VIN: C130.P$1 C131.1 C172.P$1 C173.P$1 C174.P$1 C175.P$1 C176.P$1 C177.P$1 C178.P$1 C179.P$2(+) C180.P$2(+) C181.P$2(+) D15.1(A) Q3.2/HEAT(D) Q5.2/HEAT(D) Q6.PAD2(D) Q6.PAD(D) R29.2 R34.1 R39.2 R157.2 U7.P$17(VS) U23.P$4(VIN) U30.P$19(VIN)
VM: R46.1 R54.2 U7.P$4(VM)
VWALL: C11.1 C12.P$1 D1.P$2(A) D4.P$1(C) J1.PWR JP2.2 Q1.7(.1:D) Q1.8(.1:D) Q2.2/HEAT(D) R11.2 R12.2 R41.2 R48.2 R51.1
W1_A1: R122.P$6 U16.8(A7) U27.48(B2:IO_L48P_D7_2)
W1_A2: R122.P$8 U16.6(A5) U27.51(B2:IO_L31P_GCLK31_D14_2)
W1_A3: R121.P$6 U16.4(A3) U27.56(B2:IO_L30P_GCLK1_D13_2)
W1_A4: R121.P$8 U16.2(A1) U27.58(B2:IO_L14P_D11_2)
W1_A5: R43.P$6 U6.8(A7) U27.61(B2:IO_L12N_D2_MISO3_2)
W1_A6: R43.P$8 U6.6(A5) U27.66(B2:IO_L2N_CMPMOSI_2)
W1_A7: R42.P$5 U6.5(A4) U27.67(B2:IO_L2P_CMPCLK_2)
W1_A8: R42.P$7 U6.3(A2) U27.75(B1:IO_L74P_AWAKE_1)
W1_A9: R73.P$5 U8.9(A8) U27.79(B1:IO_L47P_1)
W1_A10: R73.P$6 U8.8(A7) U27.81(B1:IO_L46P_1)
W1_A11: R73.P$8 U8.6(A5) U27.83(B1:IO_L45P_1)
W1_A12: R72.P$6 U8.4(A3) U27.85(B1:IO_L43P_GCLK5_1)
W1_A13: R72.P$8 U8.2(A1) U27.88(B1:IO_L42P_GCLK7_1)
W1_A14: U27.93(B1:IO_L41P_GCLK9_IRDY1_1)
W1_A15: U27.98(B1:IO_L34P_1)
W1_A16: U27.100(B1:IO_L33P_1)
W1_B1: U27.99(B1:IO_L33N_1)
W1_B2: U27.97(B1:IO_L34N_1)
W1_B3: U27.92(B1:IO_L41N_GCLK8_1)
W1_B4: R72.P$7 U8.3(A2) U27.87(B1:IO_L42N_GCLK6_TRDY1_1)
W1_B5: R72.P$5 U8.5(A4) U27.84(B1:IO_L43N_GCLK4_1)
W1_B6: R73.P$7 U8.7(A6) U27.82(B1:IO_L45N_1)
W1_B7: U27.80(B1:IO_L46N_1)
W1_B8: R42.P$8 U6.2(A1) U27.78(B1:IO_L47N_1)
W1_B9: R42.P$6 U6.4(A3) U27.74(B1:IO_L74N_DOUT_BUSY_1)
W1_B10: U27.95(B1:IO_L40P_GCLK11_1)
W1_B11: R43.P$7 U6.7(A6) U27.62(B2:IO_L12P_D1_MISO2_2)
W1_B12: R43.P$5 U6.9(A8) U27.59(B2:IO_L13N_D10_2)
W1_B13: R121.P$7 U16.3(A2) U27.57(B2:IO_L14N_D12_2)
W1_B14: R121.P$5 U16.5(A4) U27.55(B2:IO_L30N_GCLK0_USERCCLK_2)
W1_B15: R122.P$7 U16.7(A6) U27.50(B2:IO_L31N_GCLK30_D15_2)
W1_B16: R122.P$5 U16.9(A8) U27.47(B2:IO_L48N_RDWR_B_VREF_2)
W2_A1: U27.114(B0:IO_L65N_SCP2_0)
W2_A2: U27.115(B0:IO_L65P_SCP3_0)
W2_A3: U27.116(B0:IO_L64N_SCP4_0)
W2_A4: U27.117(B0:IO_L64P_SCP5_0)
W2_A5: U27.118(B0:IO_L63N_SCP6_0)
W2_A6: U27.119(B0:IO_L63P_SCP7_0)
W2_A7: U27.120(B0:IO_L62N_VREF_0)
W2_A8: U27.121(B0:IO_L62P_0)
W2_A9: U27.123(B0:IO_L37N_GCLK12_0)
W2_A10: U27.124(B0:IO_L37P_GCLK13_0)
W2_A11: U27.126(B0:IO_L36N_GCLK14_0)
W2_A12: U27.127(B0:IO_L36P_GCLK15_0)
W2_A13: U27.131(B0:IO_L35N_GCLK16_0)
W2_A14: U27.132(B0:IO_L35P_GCLK17_0)
W2_A15: U27.133(B0:IO_L34N_GCLK18_0)
W2_A16: U27.134(B0:IO_L34P_GCLK19_0)
WDE: JP9.2 U7.P$6(WDE)
XTIN_A: C165.2 U28.43(XTIN) X2.3(3A)
XTOUT_A: C168.2 U28.44(XTOUT) X2.1(1A)
Unconnected: IC2.40(NC) JP3.RSH JP3.TSH JP26.RSH JP26.TSH JP28.RSH JP28.TSH JP37.P$3 JP38.1(NC1) JP38.2(NC2) JP38.3(NC3) R31.P$4 R31.P$5 R68.1(CCW) R99.1(CCW) R147.1(CCW) U4.4(FB) U10.3(NC) U10.10(NC) U10.11(NC) U12.5(AIO0) U12.6(AIO1) U12.7(PIO0) U12.8(PIO1) U12.22(PIO8) U12.23(PIO7) U12.24(PIO6) U12.25(PIO5) U12.26(PIO4) U12.38(VDD_CHG) U19.36(PF7(ADC7)) U19.37(PF6(ADC6)) U19.38(PF5(ADC5)) U22.P$7(VB) U27.39(B2:IO_L65P_INIT_B_2) U27.71(B2:DONE_2) U27.72(B2:CMPCS_B_2) U27.102(B1:IO_L32P_1) U27.104(B1:IO_L1N_VREF_1) U27.111(B0:IO_L66N_SCP0_0) U28.11(ACBUS3) U28.12(ACBUS2) U28.13(ACBUS1) U28.15(ACBUS0) U28.16(ADBUS7) U28.17(ADBUS6) U28.19(ADBUS5) U28.20(ADBUS4) U28.29(BCBUS1) U28.30(BCBUS0) U28.32(BDBUS7) U28.33(BDBUS6) U28.35(BDBUS5) U28.36(BDBUS4) U28.37(BDBUS3) U28.38(BDBUS2) U28.41(PWREN#) ~NUDEV~.GND ~NUDEV~.GNDA

### Buses
GND
1V2
W1_A[1..16],W1_B[1..16],W2_A[1..16]
3V3
A[0..18],D[0..15],CS,WE,OE,BHE,BLE,!CAS,!RAS

### Notes on the sheet
- Power input and battery | Atmega32u4 and inputs | Bluetooth and microphone | Audio | Papilio Pro
- LED Strip Circuits
- Power input and battery charger
- Atmega32u4 Microcontroller
- Speaker driver and aux out | Buffer transcievers
- Bluetooth
- Power Requirements
- VCCINT requires 1.2V
- VCCAUX requires 3.3V
- VCCO's are 3.3V (no longer selectable) | Power Section
- Copyright 2012 Gadget Factory, LLC
- Rotary Encoder connector
- See more details at www.GadgetFactory.net
- Differential audio routing
- Accelerometer
- Dynamic and electret micophone input
- 93LC46B
- MIDI Input
- SPI ADC
- USB Section
- Copyright 2012 Gadget Factory, LLC
- See more details at www.GadgetFactory.net
- This work is licensed under the Creative Commons Attribution-NonCommercial-ShareAlike License.
- To view a copy of this license, visit http://creativecommons.org/ ; or, (b) send a letter to Creative Commons, 171 2nd Street, Suite 300, San Francisco, California, 94105, USA.
- SPI Flash
- JTAG
- CY7C1041D
- IS61WV25616
- IS62WV51216
- Power regulators (5V, 3.3V, 1.2V)
- JTAG Configuration
- HSWAP low pulls up all pins during configuration
- M0 high, M1 low puts FPGA in Master Serial / SPI mode
- PROG_B asserted causes a JTAG reconfiguration
- REBOOT
- FPGA Section
- Copyright 2012 Gadget Factory, LLC
- See more details at www.GadgetFactory.net
- This work is licensed under the Creative Commons Attribution-NonCommercial-ShareAlike License.
- To view a copy of this license, visit http://creativecommons.org/ ; or, (b) send a letter to Creative Commons, 171 2nd Street, Suite 300, San Francisco, California, 94105, USA.
- Review these pins
- Alternative 3.3V LDO
- Confirm the Sync pin

## Sheet 2 of 2

## Library data of the parts
$2 R1 R2 R4-R7 R9-R14 R16-R27 R29 R30 R33-R41 R44-R62 R64-R67 R69-R71 R74 R76-R81 R83-R86 R88-R97 R101-R116 R118 R120 R123-R144 R146 R148-R150 R152-R201 R204 = 1_Dan Master:RESISTOR: Resistor, Chip Mount, SMT
$3 L1-L14 = 1_Dan Master:INDUCTOR: SMT Inductor
C1-C18 C20-C84 C101-C131 C133-C143 C148-C178 C182-C184 C191-C201 = 1_Dan Master:CAPACITOR: SMT Capacitor
C19 C132 C179-C181 C185-C190 = 1_Dan Master:CAPACITOR_ELEC: Electrolytic Capacitor, SMT
C85-C100 = GadgetFactory:C: CAPACITOR, European symbol
C144-C147 = adafruit:CPOL-US: POLARIZED CAPACITOR, American symbol
D1 D3 D4 D8 D12 D13 D16 D17 = 1_Dan Master:DIODE_SMD: Diode
D2 D5-D7 D9-D11 D14 D15 LED1-LED3 = 1_Dan Master:LED: Chip Mount, SMT, LED
IC1 = 1_Dan Master:LDO: LDO 5V, 3.3
IC2 = memory-micron:MT48LC64M4A2: 256Mb: x16 SDRAM MT48LC64M4A2 - 16 Meg x 4 x 4 banks Source: http://download.micron.com/pdf/datasheets/dram/sdram/256MSDRAM.pdf; OC_FARNELL: unknown; OC_NEWARK: unknown
J1 = SparkFun-Connectors:POWER_JACK: Power Jack This is the standard 5.5mm barrel jack for power. The PTH is the most common, proven, reliable, footprint. All others are experimental. The Slot footprint only works if the mill layer is transmitted to the PCB fab house so be warned. Spark Fun Electronics SKU : PRT-00119. Mating wall wart : TOL-00298 (and others)
J2 = SparkFun-Connectors:AVR_SPI_PRG_6: AVR ISP 6 Pin This is the reduced ISP connector for AVR programming. Common on Arduino. This footprint will take up less PCB space and can be used with a 10-pin to 6-pin adapter such as SKU: BOB-08508
JP1 JP2 = SparkFun:M02: Header 2 Standard 2-pin 0.1" header. Use with straight break away headers (SKU : PRT-00116), right angle break away headers (PRT-00553), swiss pins (PRT-00743), machine pins (PRT-00117), and female headers (PRT-00115). Molex polarized connector foot print use with SKU : PRT-08233 with associated crimp pins and housings.
JP3 JP26 JP28 = SparkFun-Connectors:AUDIO-JACK2: Stereo audio jack with bypass switches.
JP4 JP7 JP9 JP11 JP12 JP14 JP18 JP21 JP24 JP27 JP29 JP33 JP34 = SparkFun-Connectors:M04: Header 4 Standard 4-pin 0.1" header. Use with straight break away headers (SKU : PRT-00116), right angle break away headers (PRT-00553), swiss pins (PRT-00743), machine pins (PRT-00117), and female headers (PRT-00115). Molex polarized connector foot print use with SKU : PRT-08231 with associated crimp pins and housings. 1MM SMD Version SKU: PRT-10208
JP5 JP6 JP25 JP35 = 1_Dan Master:HEADER-SMALL-1PIN
JP8 JP13 JP17 JP20 JP22 JP23 JP32 = SparkFun-Connectors:M02: Header 2 Standard 2-pin 0.1" header. Use with straight break away headers (SKU : PRT-00116), right angle break away headers (PRT-00553), swiss pins (PRT-00743), machine pins (PRT-00117), and female headers (PRT-00115). Molex polarized connector foot print use with SKU : PRT-08233 with associated crimp pins and housings.
JP10 JP31 JP41 = 1_Dan Master:HEADER-SMALL-2PIN
JP15 = 1_Dan Master:HEADER-SMALL-3PIN
JP16 JP19 JP36 = SparkFun-Connectors:M05: Header 5 Standard 5-pin 0.1" header. Use with straight break away headers (SKU : PRT-00116), right angle break away headers (PRT-00553), swiss pins (PRT-00743), machine pins (PRT-00117), and female headers (PRT-00115). Molex polarized connector foot print use with SKU : PRT-08230 with associated crimp pins and housings.
JP30 JP40 = adafruit:USB: USB Connectors USBMINIB - Surface Mount Female Mini-B USB Connector 4UConnector: 06564 By microbuilder.eu Thru-hole RA Female Mini-B USB Connector 4UConnector: 18732 By ladyada.net
JP37 = 1_Dan Master:HEADER-SMALL-4PIN
JP38 = GadgetFactory:MIDI_CONN_FEMALE_SUPPORT
JP39 = SparkFun-Connectors:M06: Header 6 Standard 6-pin 0.1" header. Use with straight break away headers (SKU : PRT-00116), right angle break away headers (PRT-00553), swiss pins (PRT-00743), machine pins (PRT-00117), and female headers (PRT-00115). Molex polarized connector foot print use with SKU : PRT-08094 with associated crimp pins and housings. NOTES ON THE VARIANTS LOCK and LOCK_LONGPADS... This footprint was designed to help hold the alignment of a through-hole component (i.e. 6-pin header) while soldering it into place. You may notice that each hole has been shifted either up or down by 0.005 of an inch from it's more standard position (which is a perfectly straight line). This slight alteration caused the pins (the squares in the middle) to touch the edges of the holes. Because they are alternating, it causes a "brace" to hold the component in place. 0.005 has proven to be the perfect amount of "off-center" position when using our standard breakaway headers. Although looks a little odd when you look at the bare footprint, once you have a header in there, the alteration is very hard to notice. Also, if you push a header all the way into place, it is covered up entirely on the bottom side. This idea of altering the position of holes to aid alignment will be further integrated into the Sparkfun Library for other footprints. It can help hold any component with 3 or more connection pins.
MIC1 MIC2 = SparkFun-Sensors:MIC: Omni-directional electret microphone. 9.7mm standard diameter.
OSC = MondoCPLDCore-XC95_Rev1.5:OSC1
Q1 = 1_Dan Master:MOSFET-P_CH_DUAL_ARRAY
Q2-Q5 = 1_Dan Master:MOSFET-P_CHANNEL: P-Channel MOSFET SMD, Vishay
Q6 Q7 = 1_Dan Master:MOSFET_N_CHANNEL: N-Channel MOSFET
R3 R8 R15 R28 R31 R32 R42 R43 R63 R72 R73 R75 R82 R87 R98 R100 R117 R119 R121 R122 R145 R151 = 1_Dan Master:RESISTOR_ARRAY_4CH: Resistor Array 4 channel ACASA - 50k @0.5% (http://www.vishay.com/docs/28770/acasat.pdf) ACASA - 10k @0.5% (http://www.vishay.com/docs/28754/acaprof.pdf)
R68 R99 R147 = SparkFun-Electromechanical:TRIMPOT: Various small potentiometers for "set-and-forget" applications
RT1 = 1_Dan Master:THERMISTOR: SMT Thermistor SMD
S8 = SparkFun-Electromechanical:SWITCH-MOMENTARY-2: Various NO switches- pushbuttons, reed, etc
SW3 SW5 = adafruit:SPST_TACT: SMT 6mm switch, EVQQ2 series http://www.ladyada.net/library/eagle
U2 = 1_Dan Master:ADC128S102
U3 = 1_Dan Master:LTC4002: LT battery charger (1 or 2 cell li-po)
U4 U24 U25 = 1_Dan Master:LDO_EN_FB
U5 U11 U14 U17 = 1_Dan Master:NJM2068: NJM audio op amp
U6 U8 U16 = 1_Dan Master:SN74HCT541
U7 = 1_Dan Master:LTC2952: Pushbutton powerpath controller
U9 = 1_Dan Master:TPA2008D2
U10 = SparkFun:ADXL345
U12 = 1_Dan Master:WT32
U13 = 1_Dan Master:USBLC6-2
U15 = 1_Dan Master:TPA6130A2
U18 U20 = 1_Dan Master:TS5A22364
U19 = 1_Dan Master:ATMEGA32U4: ATmega 32U4 Datasheet: http://www.atmel.com/dyn/resources/prod_documents/7766S.pdf Verified DJB 11/8/11
U21 U26 = GadgetFactory:FLASH-SPI-25XX: SPI Flash
U22 = 1_Dan Master:6N138: MOTOROLA OPTO COUPLER
U23 = 1_Dan Master:LT3971: High voltage buck-regulator
U27 = xilinx_devices:6SLX9TQG144: Xilinx FPGA: 6SLX9TQG144
U28 = Bogdan_Commons:FT2232D
U29 = Bogdan_Commons:DIGITAL-EEPROM-MICROWIRE-6P
U30 = 1_Dan Master:LTC3891
X1 X2 = 1_Dan Master:ABRACOM_CLOCKS_AB: Crystals by abracom SMD/SMT
~NUDEV~ = supply1:GND-GNDA: Example of GND--GNDA NET-Connetor for more info see description in package

## Net classes
0 default: width 0.178 mm, drill 0.381 mm, clearance 0.178 mm